# EAGLE schematic MAIN_CNTRL_v02 (EAGLE 9.7.0)

## Sheet 1 of 6: Power
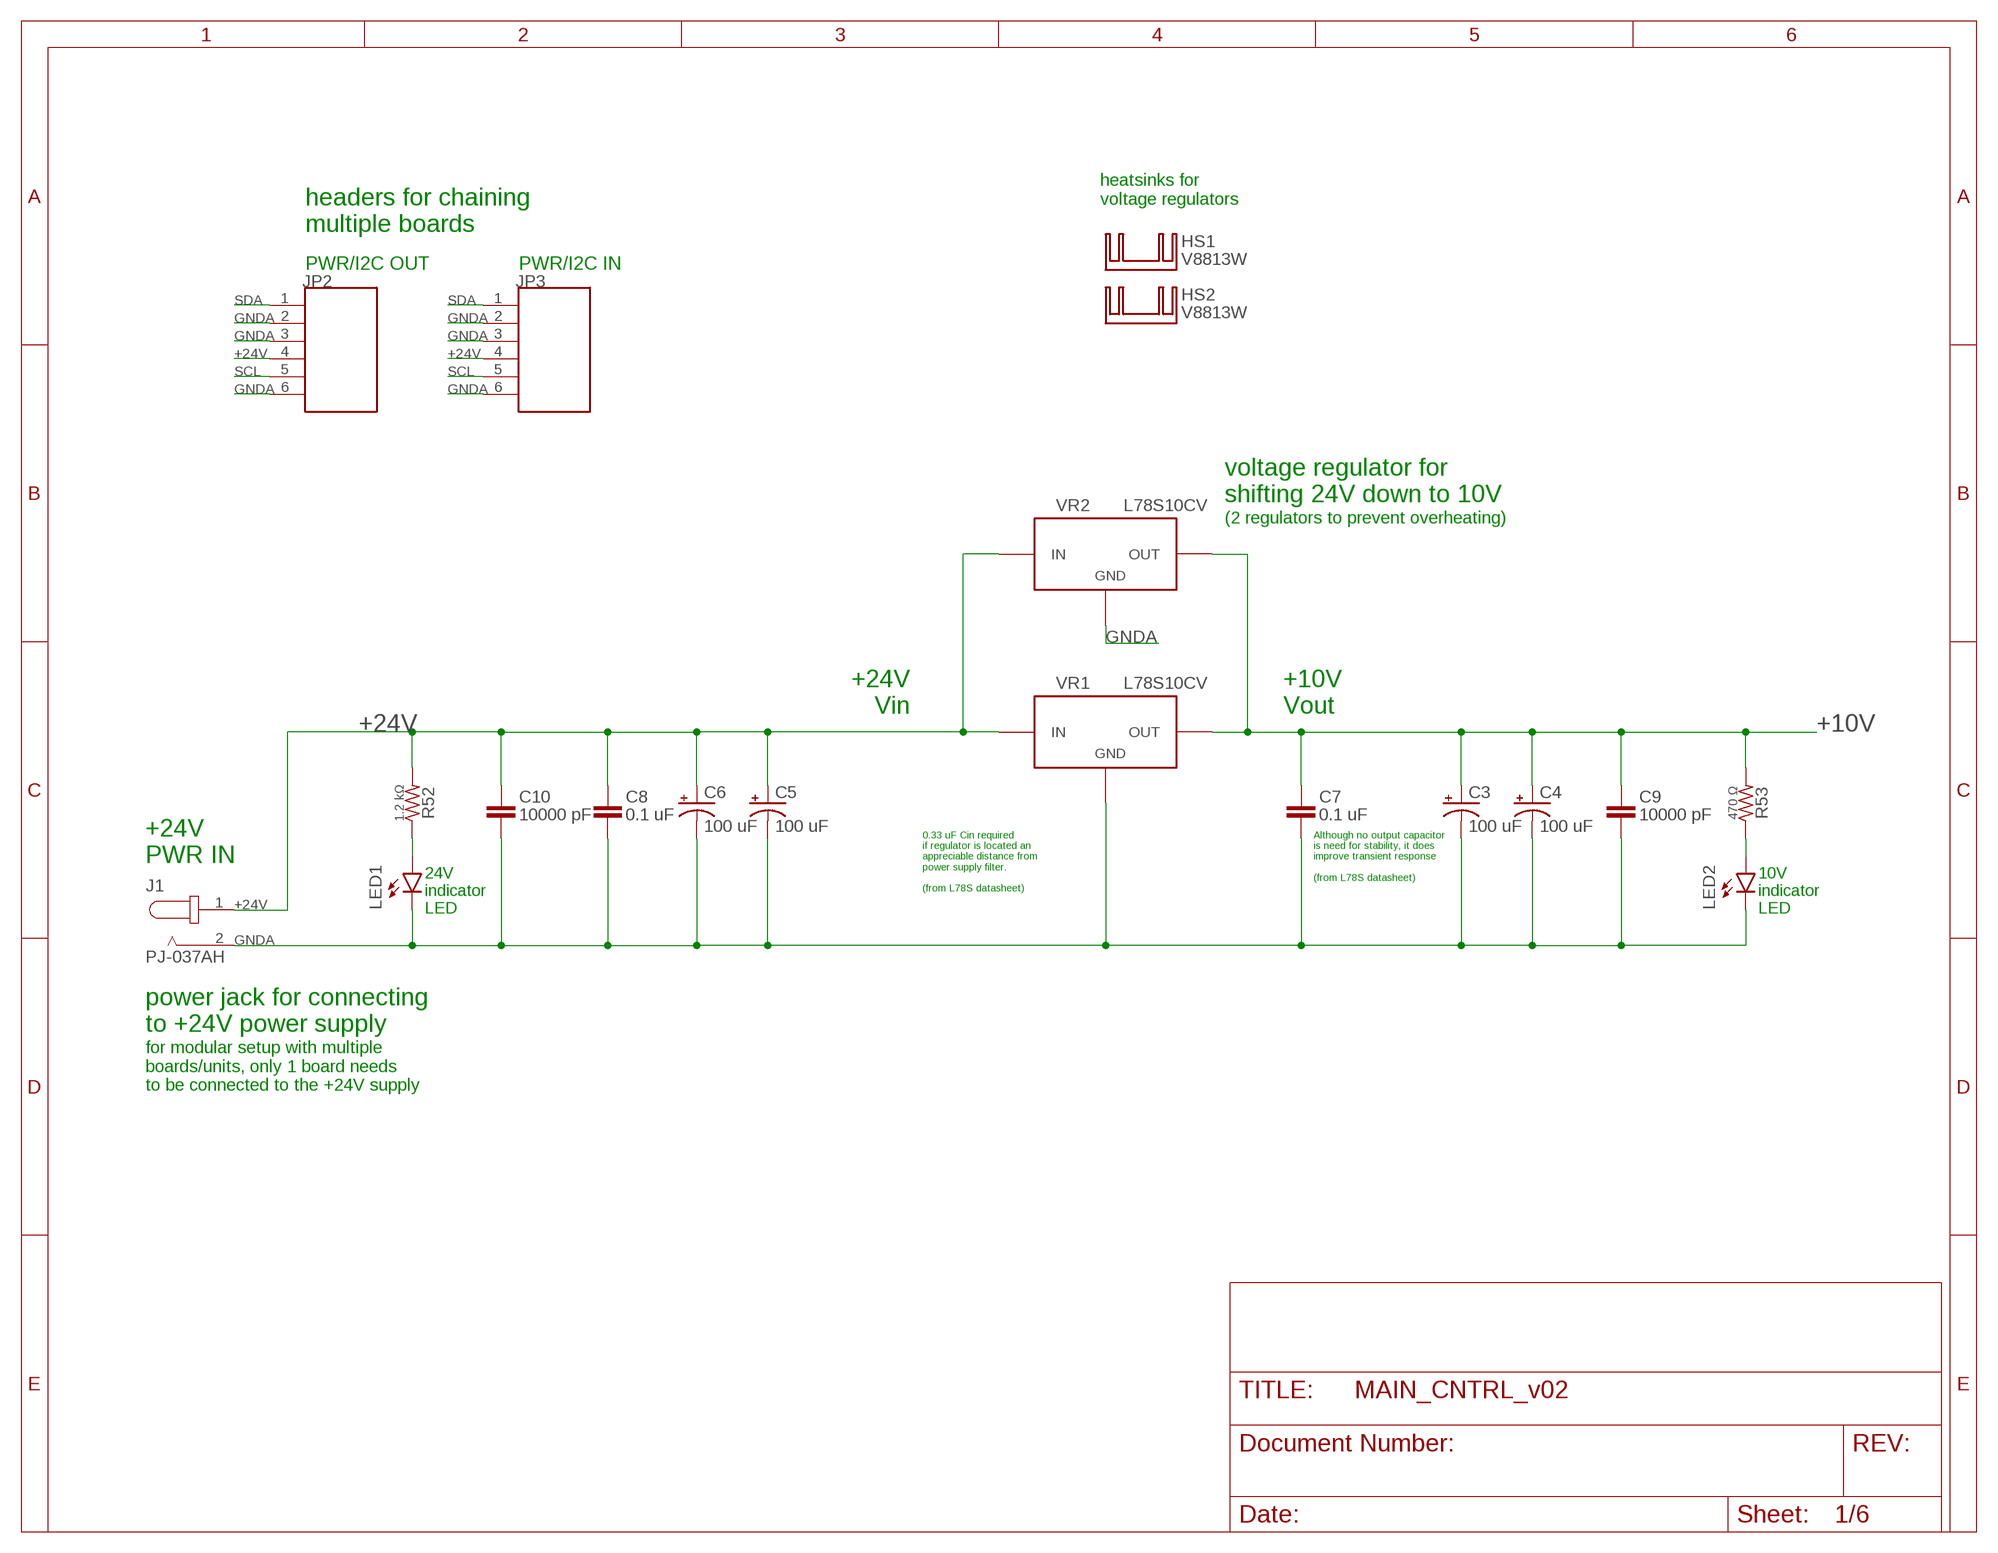
[diagram p0: schematic, sheet 1]

### Parts
C3  100 uF  50THV100M10X10.5  [CAP_J-V_10X10P5_RUB]
C4  100 uF  50THV100M10X10.5  [CAP_J-V_10X10P5_RUB]
C5  100 uF  50THV100M10X10.5  [CAP_J-V_10X10P5_RUB]
C6  100 uF  50THV100M10X10.5  [CAP_J-V_10X10P5_RUB]
C7  0.1 uF  CAP_CGA3E2X7R1H104M080AD  [CAP_1608_TDK]
C8  0.1 uF  CAP_CGA3E2X7R1H104M080AD  [CAP_1608_TDK]
C9  10000 pF  CAP_CGA3E2X7R1H103K080AE  [CAP_1608_TDK]
C10  10000 pF  CAP_CGA3E2X7R1H103K080AE  [CAP_1608_TDK]
HS1  V8813W  [V8813X]
HS2  V8813W  [V8813X]
J1  PJ-037AH  [CUI_PJ-037AH]
JP2  CONN_06_HEADER  [CONN_6P_TE_1761681-1]
JP3  CONN_06_HEADER  [CONN_6P_TE_1761681-1]
LED1  Green LED  LED_VLMG_1300  [LED_VISHAY_VLMX13XX]
LED2  Green LED  LED_VLMG_1300  [LED_VISHAY_VLMX13XX]
R52  1.2 kΩ  RCS06031K20FKEA  [RCS0603_REFLOW]
R53  470 Ω  RCS0603470RFKEA  [RCS0603_REFLOW]
VR1  L78S10CV  [L78S10CV]
VR2  L78S10CV  [L78S10CV]

### Nets
+10V: C3.+ C4.+ C7.1 C9.1 R53.2 VR1.3(OUT) VR2.3(OUT) ; also sheet 2,3,4,6
+24V: C5.+ C6.+ C8.1 C10.1 J1.1 JP2.4 JP3.4 R52.2 VR1.1(IN) VR2.1(IN) ; also sheet 3,4,5,6
GNDA: C3.- C4.- C5.- C6.- C7.2 C8.2 C9.2 C10.2 J1.2 JP2.2 JP2.3 JP2.6 JP3.2 JP3.3 JP3.6 LED1.C LED2.C VR1.2(GND) VR2.2(GND) ; also sheet 2,3,4,5,6
N$18_: LED1.A R52.1
N$19_: LED2.A R53.1
SCL: JP2.5 JP3.5 ; also sheet 2
SDA: JP2.1 JP3.1 ; also sheet 2

### Notes on the sheet
- heatsinks for
  voltage regulators
- headers for chaining
  multiple boards
- PWR/I2C OUT | PWR/I2C IN
- voltage regulator for
  shifting 24V down to 10V
- (2 regulators to prevent overheating)
- +24V
  Vin
- +10V
  Vout
- 0.33 uF Cin required
  if regulator is located an 
  appreciable distance from 
  power supply filter.
  
  (from L78S datasheet)
- Although no output capacitor
  is need for stability, it does
  improve transient response
  
  (from L78S datasheet)
- +24V
  PWR IN
- 24V
  indicator
  LED
- 10V
  indicator
  LED
- power jack for connecting
  to +24V power supply
- for modular setup with multiple
  boards/units, only 1 board needs
  to be connected to the +24V supply

## Sheet 2 of 6: Arduino etc
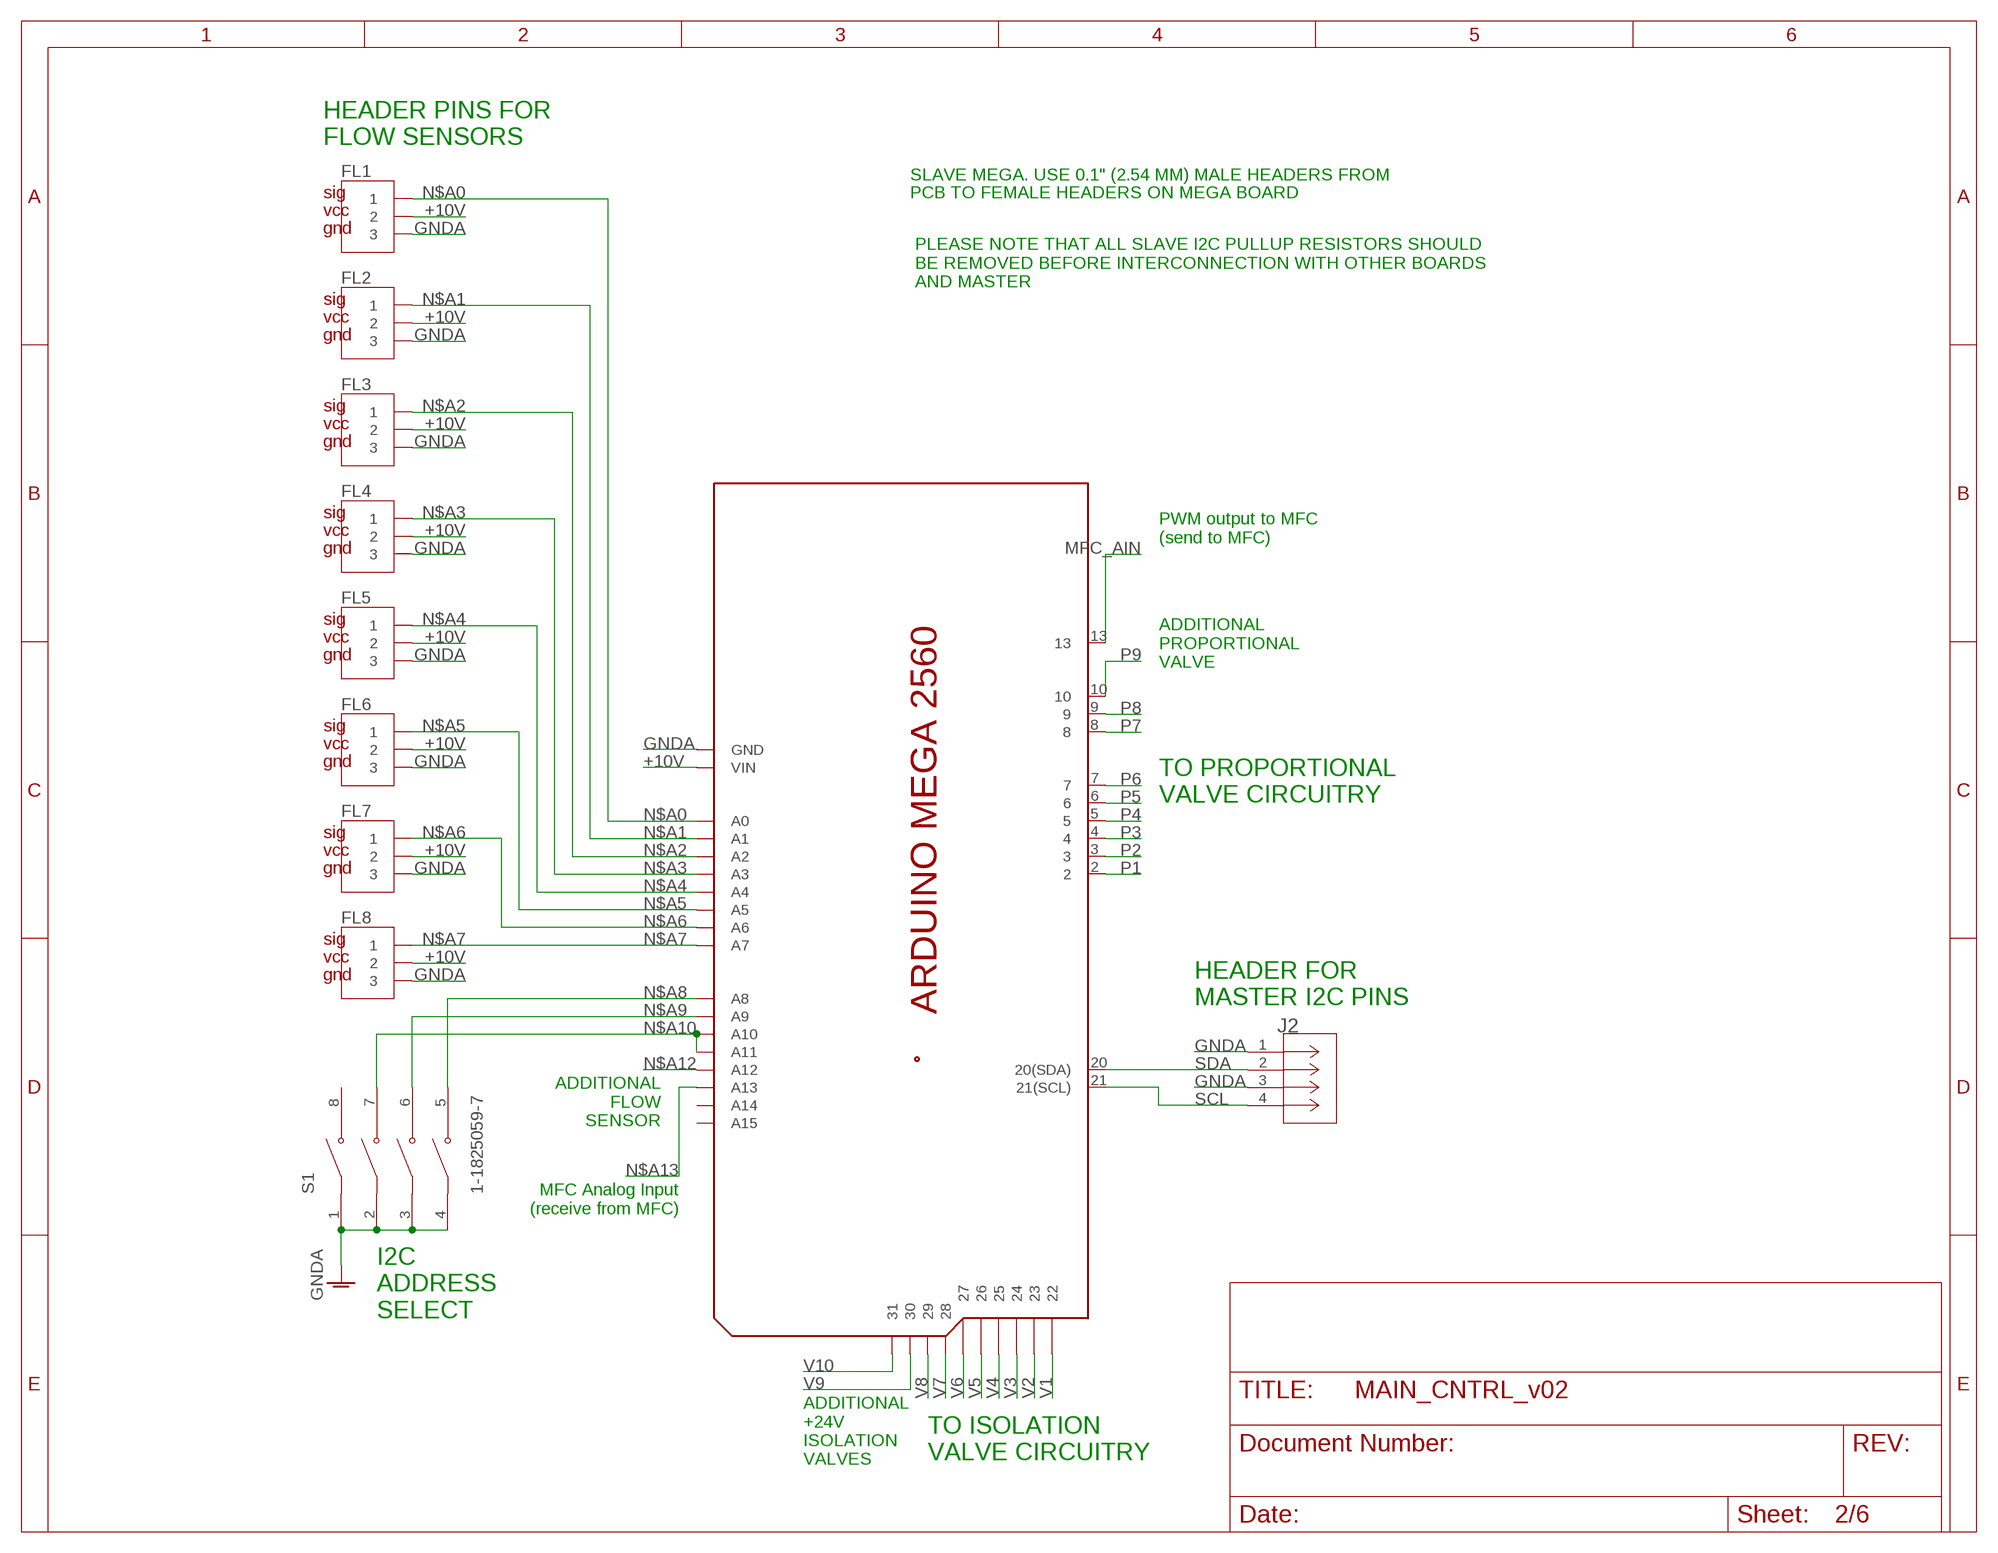
[diagram p1: schematic, sheet 2]

### Parts
FL1  CONN_03_FL  [1X03_FL]
FL2  CONN_03_FL  [1X03_FL]
FL3  CONN_03_FL  [1X03_FL]
FL4  CONN_03_FL  [1X03_FL]
FL5  CONN_03_FL  [1X03_FL]
FL6  CONN_03_FL  [1X03_FL]
FL7  CONN_03_FL  [1X03_FL]
FL8  CONN_03_FL  [1X03_FL]
J2  MOLEX_436500415  [MOLEX_4P_FOOTPRINT]
S1  1-1825059-7  [SW_1-1825059-7]
X1  ARDUINO_MEGA2560_HEADERPINSXX  ARDUINO_MEGA2560  [ARDUINO_MEGA2560_ST_FLIPPED_CUTS]

### Nets
+10V: FL1.2 FL2.2 FL3.2 FL4.2 FL5.2 FL6.2 FL7.2 FL8.2 X1.VIN ; also sheet 1,3,4,6
GNDA: FL1.3 FL2.3 FL3.3 FL4.3 FL5.3 FL6.3 FL7.3 FL8.3 J2.1 J2.3 S1.1 S1.2 S1.3 S1.4 X1.GND X1.GND.(GND) X1.GND..(GND) ; also sheet 1,3,4,5,6
MFC_AIN: X1.13 ; also sheet 6
N$A0: FL1.1 X1.A0
N$A1: FL2.1 X1.A1
N$A2: FL3.1 X1.A2
N$A3: FL4.1 X1.A3
N$A4: FL5.1 X1.A4
N$A5: FL6.1 X1.A5
N$A6: FL7.1 X1.A6
N$A7: FL8.1 X1.A7
N$A8: S1.5 X1.A8
N$A9: S1.6 X1.A9
N$A10: S1.7 X1.A10 X1.A11
N$A12: X1.A12 ; also sheet 6
N$A13: X1.A13 ; also sheet 6
P1: X1.2 ; also sheet 3
P2: X1.3 ; also sheet 3
P3: X1.4 ; also sheet 3
P4: X1.5 ; also sheet 3
P5: X1.6 ; also sheet 4
P6: X1.7 ; also sheet 4
P7: X1.8 ; also sheet 4
P8: X1.9 ; also sheet 4
P9: X1.10 ; also sheet 6
SCL: J2.4 X1.21(21(SCL)) ; also sheet 1
SDA: J2.2 X1.20(20(SDA)) ; also sheet 1
V1: X1.22 ; also sheet 5
V2: X1.23 ; also sheet 5
V3: X1.24 ; also sheet 5
V4: X1.25 ; also sheet 5
V5: X1.26 ; also sheet 5
V6: X1.27 ; also sheet 5
V7: X1.28 ; also sheet 5
V8: X1.29 ; also sheet 5
V9: X1.30 ; also sheet 6
V10: X1.31 ; also sheet 6
Unconnected: S1.8 X1.A14 X1.A15

### Notes on the sheet
- HEADER PINS FOR
  FLOW SENSORS
- SLAVE MEGA. USE 0.1" (2.54 MM) MALE HEADERS FROM
- PCB TO FEMALE HEADERS ON MEGA BOARD
- PLEASE NOTE THAT ALL SLAVE I2C PULLUP RESISTORS SHOULD
   BE REMOVED BEFORE INTERCONNECTION WITH OTHER BOARDS
   AND MASTER
- PWM output to MFC
  (send to MFC)
- ADDITIONAL
  PROPORTIONAL
  VALVE
- TO PROPORTIONAL
  VALVE CIRCUITRY
- HEADER FOR
  MASTER I2C PINS
- ADDITIONAL
  FLOW
  SENSOR
- MFC Analog Input
  (receive from MFC)
- I2C
  ADDRESS
  SELECT
- ADDITIONAL
  +24V
  ISOLATION
  VALVES
- TO ISOLATION
  VALVE CIRCUITRY

## Sheet 3 of 6: Prop.Valves 1-4
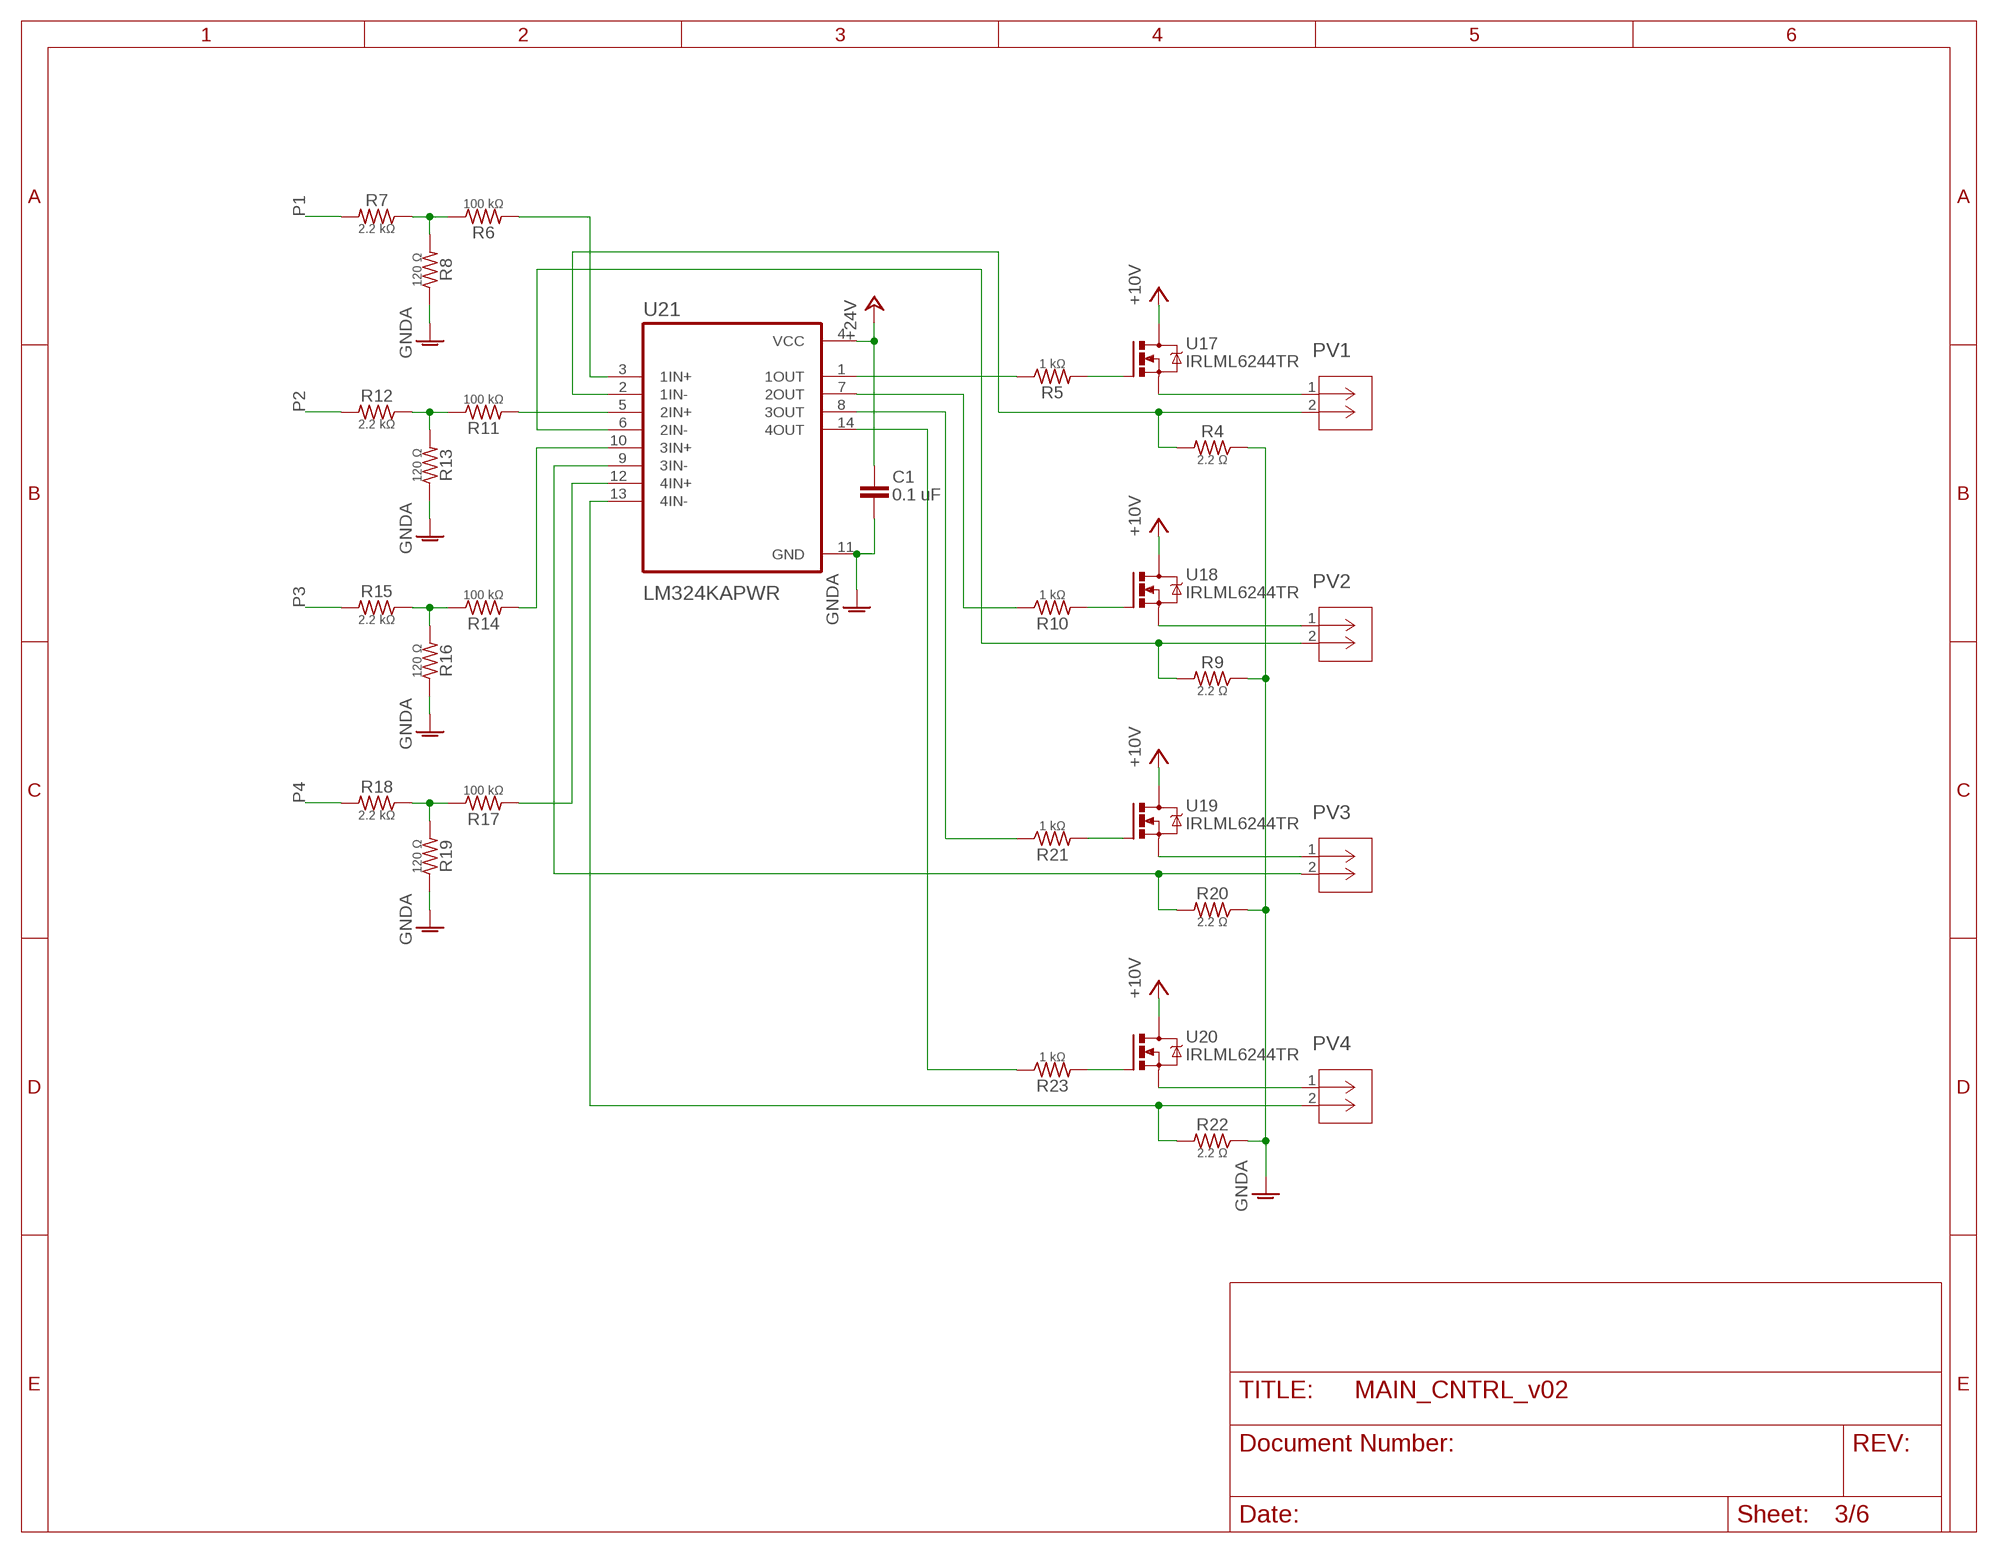
[diagram p2: schematic, sheet 3]

### Parts
C1  0.1 uF  CAP_CGA3E2X7R1H104M080AD  [CAP_1608_TDK]
PV1  MOLEX_436500215PVALVES  [MOLEX_2P_PVALVES]
PV2  MOLEX_436500215PVALVES  [MOLEX_2P_PVALVES]
PV3  MOLEX_436500215PVALVES  [MOLEX_2P_PVALVES]
PV4  MOLEX_436500215PVALVES  [MOLEX_2P_PVALVES]
R4  2.2 Ω  CRCW12062R20FKEA  [CRCW1206_E3_REFLOW]
R5  1 kΩ  ERJPA3F1001V  [RES_ERJPA3F1001V]
R6  100 kΩ  SR0603FR-7T100KL  [RESC1608X55N]
R7  2.2 kΩ  SR0603FR-7T2K2L  [RESC1608X55N]
R8  120 Ω  RCS0603120RFKEA  [RCS0603_REFLOW]
R9  2.2 Ω  CRCW12062R20FKEA  [CRCW1206_E3_REFLOW]
R10  1 kΩ  ERJPA3F1001V  [RES_ERJPA3F1001V]
R11  100 kΩ  SR0603FR-7T100KL  [RESC1608X55N]
R12  2.2 kΩ  SR0603FR-7T2K2L  [RESC1608X55N]
R13  120 Ω  RCS0603120RFKEA  [RCS0603_REFLOW]
R14  100 kΩ  SR0603FR-7T100KL  [RESC1608X55N]
R15  2.2 kΩ  SR0603FR-7T2K2L  [RESC1608X55N]
R16  120 Ω  RCS0603120RFKEA  [RCS0603_REFLOW]
R17  100 kΩ  SR0603FR-7T100KL  [RESC1608X55N]
R18  2.2 kΩ  SR0603FR-7T2K2L  [RESC1608X55N]
R19  120 Ω  RCS0603120RFKEA  [RCS0603_REFLOW]
R20  2.2 Ω  CRCW12062R20FKEA  [CRCW1206_E3_REFLOW]
R21  1 kΩ  ERJPA3F1001V  [RES_ERJPA3F1001V]
R22  2.2 Ω  CRCW12062R20FKEA  [CRCW1206_E3_REFLOW]
R23  1 kΩ  ERJPA3F1001V  [RES_ERJPA3F1001V]
U17  IRLML6244TR  [SOT23]
U18  IRLML6244TR  [SOT23]
U19  IRLML6244TR  [SOT23]
U20  IRLML6244TR  [SOT23]
U21  LM324KAPWR  [SOP65P640X120-14N]

### Nets
+10V: U17.3(D) U18.3(D) U19.3(D) U20.3(D) ; also sheet 1,2,4,6
+24V: C1.1 U21.4(VCC) ; also sheet 1,4,5,6
GNDA: C1.2 R4.1 R8.1 R9.1 R13.1 R16.1 R19.1 R20.1 R22.1 U21.11(GND) ; also sheet 1,2,4,5,6
N$11: R6.1 R7.1 R8.2
N$12: R6.2 U21.3(1IN+)
N$13: R5.2 U17.1(G)
N$21: R11.1 R12.1 R13.2
N$22: R11.2 U21.5(2IN+)
N$23: R10.2 U18.1(G)
N$31: R14.1 R15.1 R16.2
N$32: R14.2 U21.10(3IN+)
N$33: R21.2 U19.1(G)
N$41: R17.1 R18.1 R19.2
N$42: R17.2 U21.12(4IN+)
N$43: R23.2 U20.1(G)
N$PV1_1: PV1.1 U17.2(S)
N$PV1_2: PV1.2 R4.2 U21.2(1IN-)
N$PV1_OUT: R5.1 U21.1(1OUT)
N$PV2_1: PV2.1 U18.2(S)
N$PV2_2: PV2.2 R9.2 U21.6(2IN-)
N$PV2_OUT: R10.1 U21.7(2OUT)
N$PV3_1: PV3.1 U19.2(S)
N$PV3_2: PV3.2 R20.2 U21.9(3IN-)
N$PV3_OUT: R21.1 U21.8(3OUT)
N$PV4_1: PV4.1 U20.2(S)
N$PV4_2: PV4.2 R22.2 U21.13(4IN-)
N$PV4_OUT: R23.1 U21.14(4OUT)
P1: R7.2 ; also sheet 2
P2: R12.2 ; also sheet 2
P3: R15.2 ; also sheet 2
P4: R18.2 ; also sheet 2

## Sheet 4 of 6: Prop. Valves 5-8
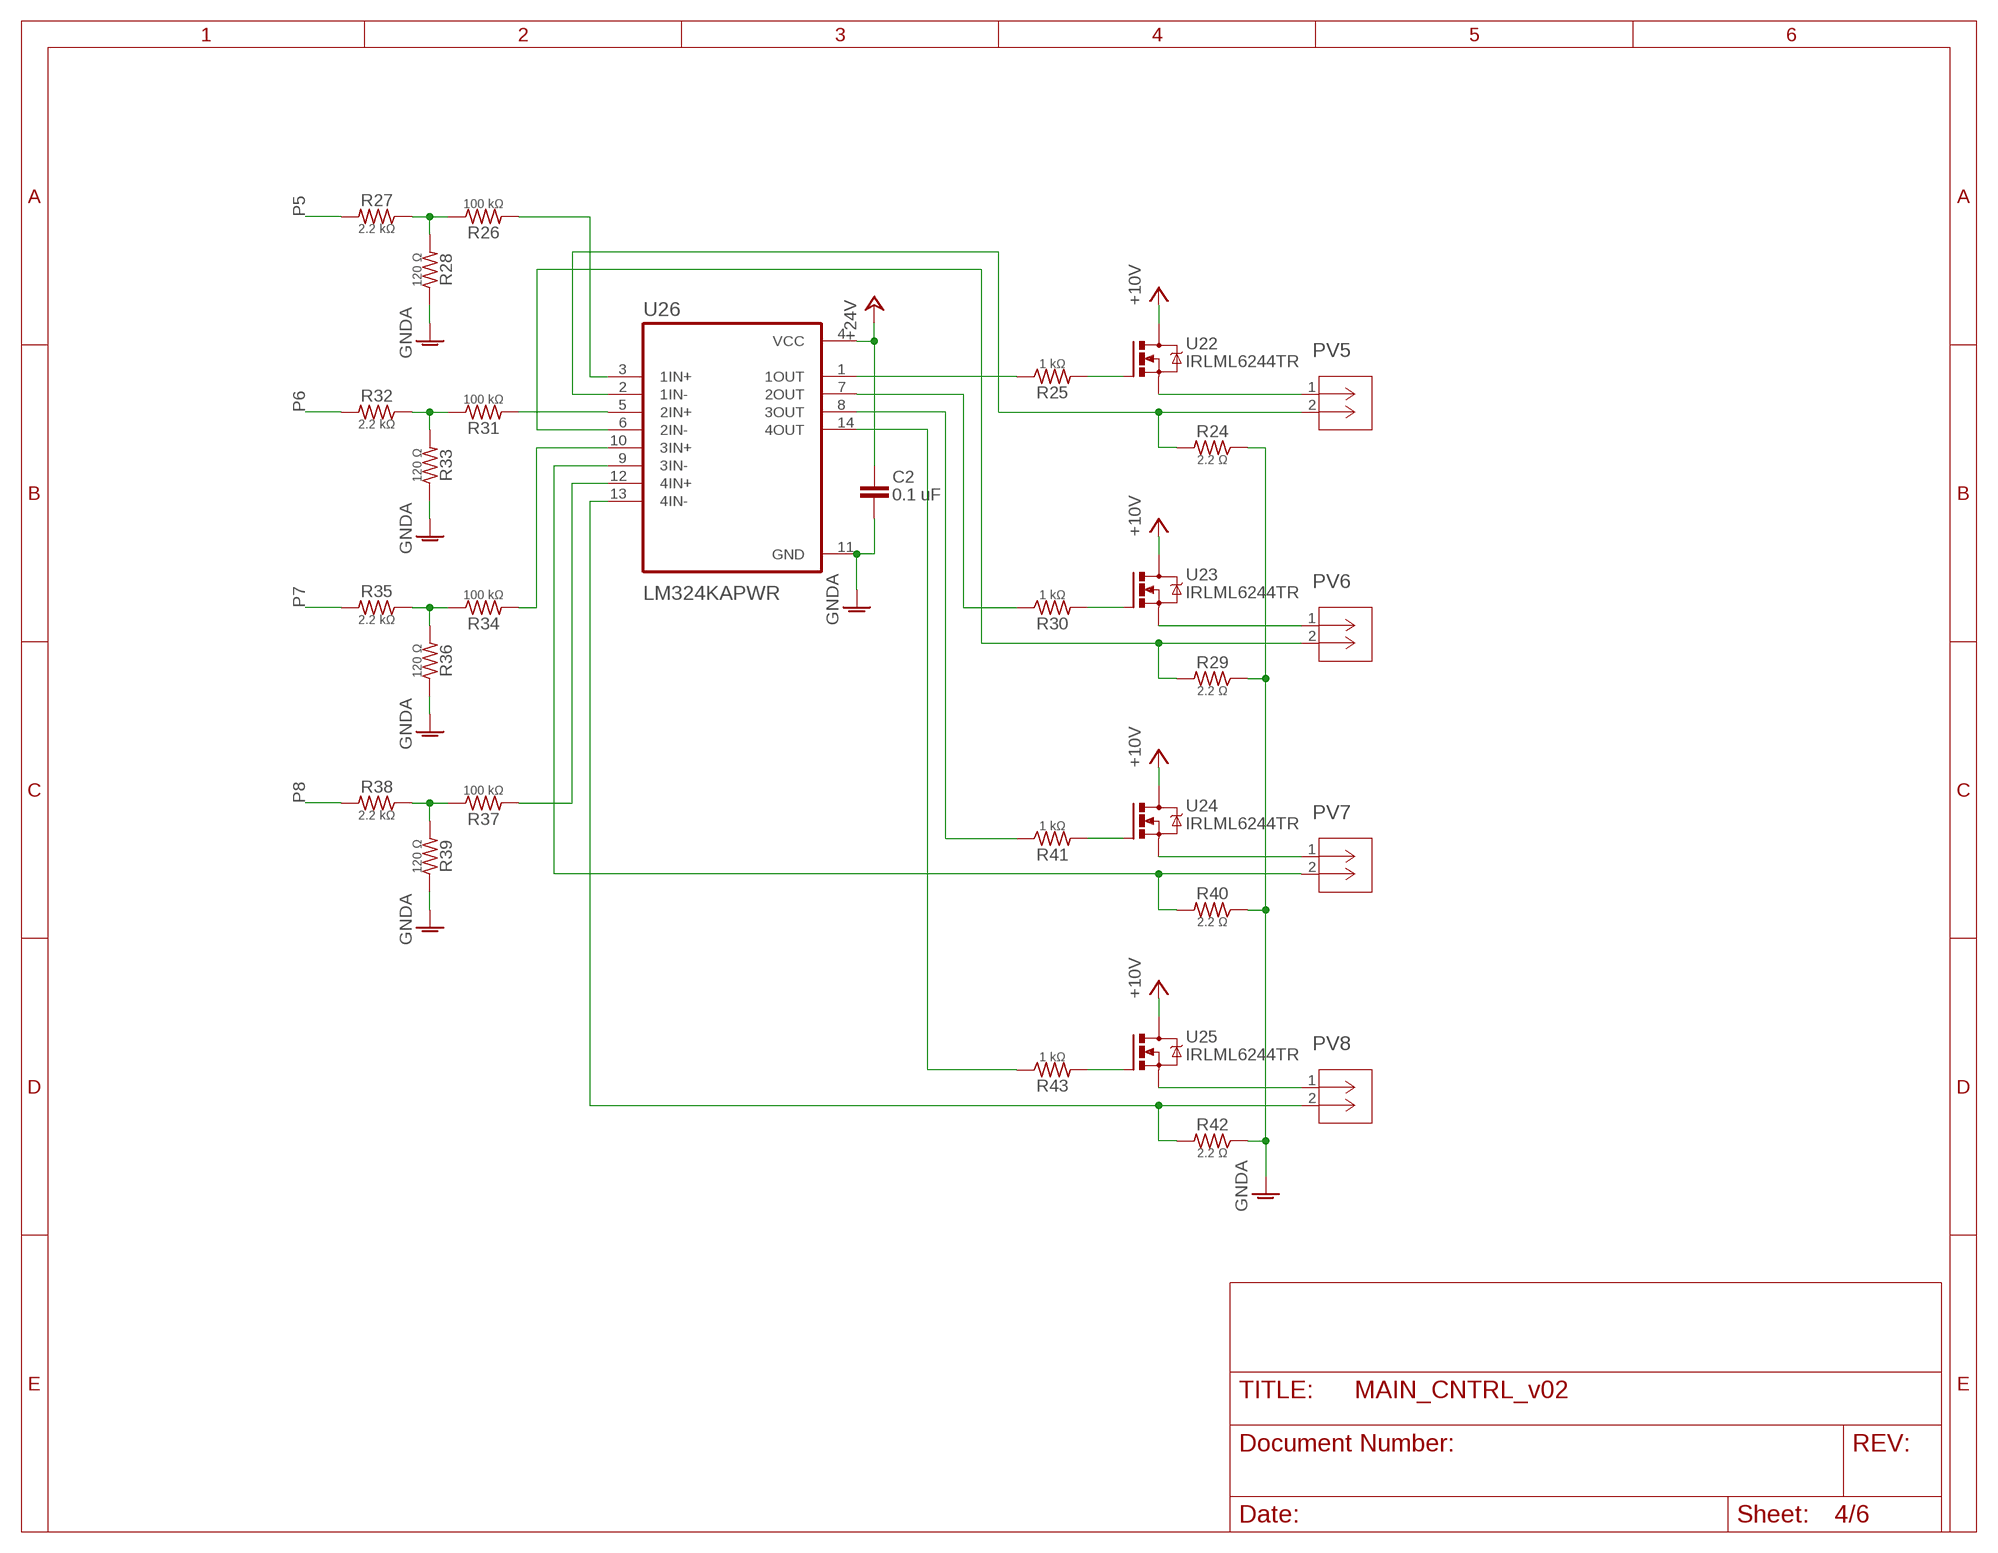
[diagram p3: schematic, sheet 4]

### Parts
C2  0.1 uF  CAP_CGA3E2X7R1H104M080AD  [CAP_1608_TDK]
PV5  MOLEX_436500215PVALVES  [MOLEX_2P_PVALVES]
PV6  MOLEX_436500215PVALVES  [MOLEX_2P_PVALVES]
PV7  MOLEX_436500215PVALVES  [MOLEX_2P_PVALVES]
PV8  MOLEX_436500215PVALVES  [MOLEX_2P_PVALVES]
R24  2.2 Ω  CRCW12062R20FKEA  [CRCW1206_E3_REFLOW]
R25  1 kΩ  ERJPA3F1001V  [RES_ERJPA3F1001V]
R26  100 kΩ  SR0603FR-7T100KL  [RESC1608X55N]
R27  2.2 kΩ  SR0603FR-7T2K2L  [RESC1608X55N]
R28  120 Ω  RCS0603120RFKEA  [RCS0603_REFLOW]
R29  2.2 Ω  CRCW12062R20FKEA  [CRCW1206_E3_REFLOW]
R30  1 kΩ  ERJPA3F1001V  [RES_ERJPA3F1001V]
R31  100 kΩ  SR0603FR-7T100KL  [RESC1608X55N]
R32  2.2 kΩ  SR0603FR-7T2K2L  [RESC1608X55N]
R33  120 Ω  RCS0603120RFKEA  [RCS0603_REFLOW]
R34  100 kΩ  SR0603FR-7T100KL  [RESC1608X55N]
R35  2.2 kΩ  SR0603FR-7T2K2L  [RESC1608X55N]
R36  120 Ω  RCS0603120RFKEA  [RCS0603_REFLOW]
R37  100 kΩ  SR0603FR-7T100KL  [RESC1608X55N]
R38  2.2 kΩ  SR0603FR-7T2K2L  [RESC1608X55N]
R39  120 Ω  RCS0603120RFKEA  [RCS0603_REFLOW]
R40  2.2 Ω  CRCW12062R20FKEA  [CRCW1206_E3_REFLOW]
R41  1 kΩ  ERJPA3F1001V  [RES_ERJPA3F1001V]
R42  2.2 Ω  CRCW12062R20FKEA  [CRCW1206_E3_REFLOW]
R43  1 kΩ  ERJPA3F1001V  [RES_ERJPA3F1001V]
U22  IRLML6244TR  [SOT23]
U23  IRLML6244TR  [SOT23]
U24  IRLML6244TR  [SOT23]
U25  IRLML6244TR  [SOT23]
U26  LM324KAPWR  [SOP65P640X120-14N]

### Nets
+10V: U22.3(D) U23.3(D) U24.3(D) U25.3(D) ; also sheet 1,2,3,6
+24V: C2.1 U26.4(VCC) ; also sheet 1,3,5,6
GNDA: C2.2 R24.1 R28.1 R29.1 R33.1 R36.1 R39.1 R40.1 R42.1 U26.11(GND) ; also sheet 1,2,3,5,6
N$51: R26.1 R27.1 R28.2
N$52: R26.2 U26.3(1IN+)
N$53: R25.2 U22.1(G)
N$61: R31.1 R32.1 R33.2
N$62: R31.2 U26.5(2IN+)
N$63: R30.2 U23.1(G)
N$71: R34.1 R35.1 R36.2
N$72: R34.2 U26.10(3IN+)
N$73: R41.2 U24.1(G)
N$81: R37.1 R38.1 R39.2
N$82: R37.2 U26.12(4IN+)
N$83: R43.2 U25.1(G)
N$PV5_1: PV5.1 U22.2(S)
N$PV5_2: PV5.2 R24.2 U26.2(1IN-)
N$PV5_OUT: R25.1 U26.1(1OUT)
N$PV6_1: PV6.1 U23.2(S)
N$PV6_2: PV6.2 R29.2 U26.6(2IN-)
N$PV6_OUT: R30.1 U26.7(2OUT)
N$PV7_1: PV7.1 U24.2(S)
N$PV7_2: PV7.2 R40.2 U26.9(3IN-)
N$PV7_OUT: R41.1 U26.8(3OUT)
N$PV8_1: PV8.1 U25.2(S)
N$PV8_2: PV8.2 R42.2 U26.13(4IN-)
N$PV8_OUT: R43.1 U26.14(4OUT)
P5: R27.2 ; also sheet 2
P6: R32.2 ; also sheet 2
P7: R35.2 ; also sheet 2
P8: R38.2 ; also sheet 2

## Sheet 5 of 6: Isolation Valves
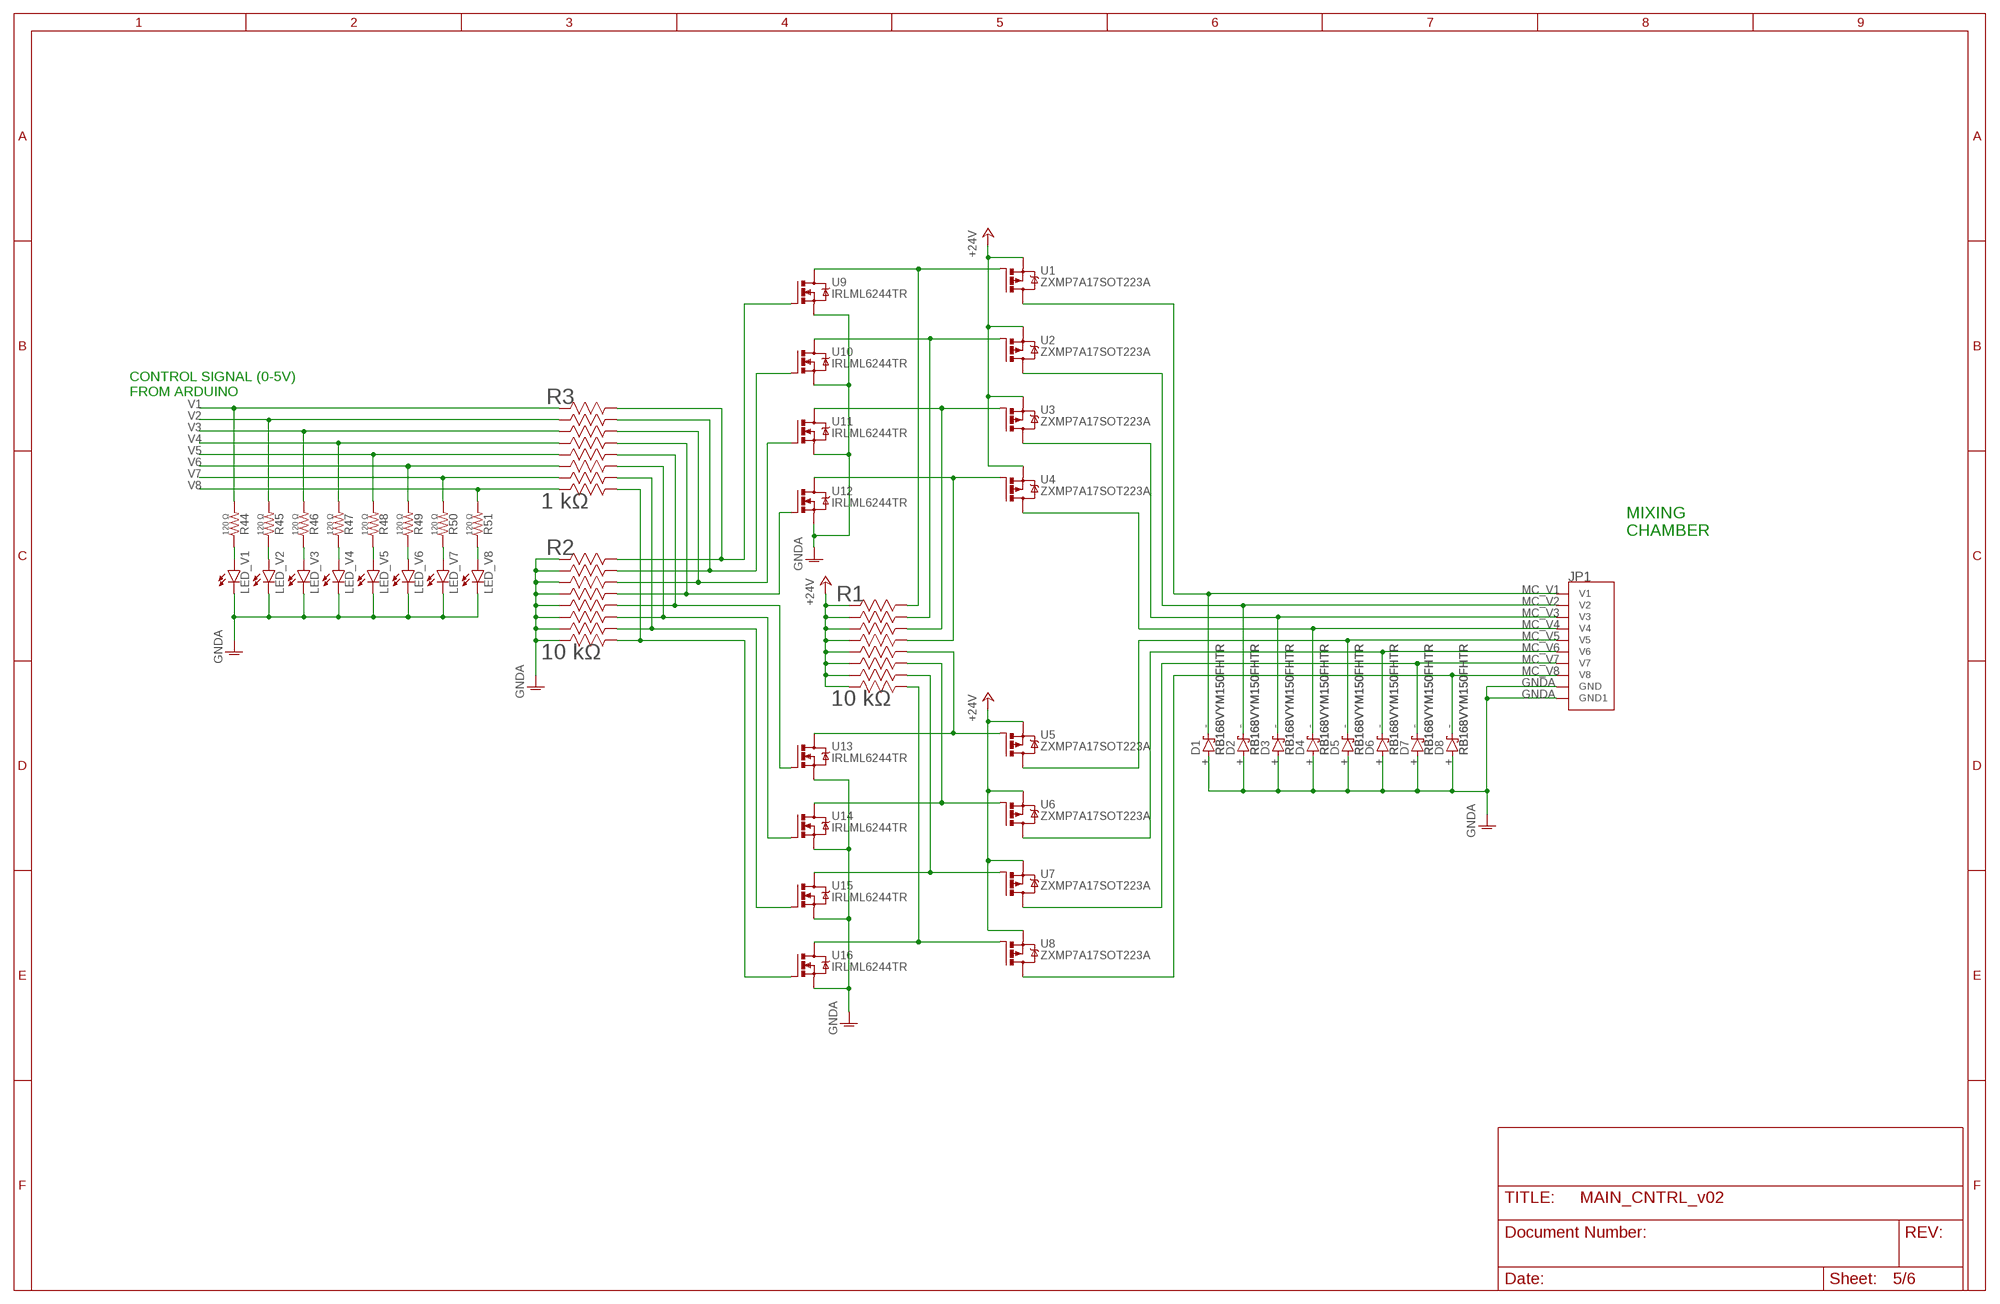
[diagram p4: schematic, sheet 5]

### Parts
D1  RB168VYM150FHTR  [DIO_RB160VAM_ROM]
D2  RB168VYM150FHTR  [DIO_RB160VAM_ROM]
D3  RB168VYM150FHTR  [DIO_RB160VAM_ROM]
D4  RB168VYM150FHTR  [DIO_RB160VAM_ROM]
D5  RB168VYM150FHTR  [DIO_RB160VAM_ROM]
D6  RB168VYM150FHTR  [DIO_RB160VAM_ROM]
D7  RB168VYM150FHTR  [DIO_RB160VAM_ROM]
D8  RB168VYM150FHTR  [DIO_RB160VAM_ROM]
JP1  CONN_10P_CUSTOM_N2510-6002RBV02  CONN_10P_TE_1761681-3  [CONN_10P_TE_1761681-3_SE_FOR_V02]
LED_V1  Blue LED  LED_VLMB_1300  [LED_VISHAY_VLMX13XX]
LED_V2  Blue LED  LED_VLMB_1300  [LED_VISHAY_VLMX13XX]
LED_V3  Blue LED  LED_VLMB_1300  [LED_VISHAY_VLMX13XX]
LED_V4  Blue LED  LED_VLMB_1300  [LED_VISHAY_VLMX13XX]
LED_V5  Blue LED  LED_VLMB_1300  [LED_VISHAY_VLMX13XX]
LED_V6  Blue LED  LED_VLMB_1300  [LED_VISHAY_VLMX13XX]
LED_V7  Blue LED  LED_VLMB_1300  [LED_VISHAY_VLMX13XX]
LED_V8  Blue LED  LED_VLMB_1300  [LED_VISHAY_VLMX13XX]
R1  10 kΩ  RES_4816P-1-103LF  [BO_4816P]
R2  10 kΩ  RES_4816P-1-103LF  [BO_4816P]
R3  1 kΩ  RES_4816P-1-102LF  [BO_4816P]
R44  120 Ω  RCS0603120RFKEA  [RCS0603_REFLOW]
R45  120 Ω  RCS0603120RFKEA  [RCS0603_REFLOW]
R46  120 Ω  RCS0603120RFKEA  [RCS0603_REFLOW]
R47  120 Ω  RCS0603120RFKEA  [RCS0603_REFLOW]
R48  120 Ω  RCS0603120RFKEA  [RCS0603_REFLOW]
R49  120 Ω  RCS0603120RFKEA  [RCS0603_REFLOW]
R50  120 Ω  RCS0603120RFKEA  [RCS0603_REFLOW]
R51  120 Ω  RCS0603120RFKEA  [RCS0603_REFLOW]
U1  ZXMP7A17SOT223A  [SOT223]
U2  ZXMP7A17SOT223A  [SOT223]
U3  ZXMP7A17SOT223A  [SOT223]
U4  ZXMP7A17SOT223A  [SOT223]
U5  ZXMP7A17SOT223A  [SOT223]
U6  ZXMP7A17SOT223A  [SOT223]
U7  ZXMP7A17SOT223A  [SOT223]
U8  ZXMP7A17SOT223A  [SOT223]
U9  IRLML6244TR  [SOT23]
U10  IRLML6244TR  [SOT23]
U11  IRLML6244TR  [SOT23]
U12  IRLML6244TR  [SOT23]
U13  IRLML6244TR  [SOT23]
U14  IRLML6244TR  [SOT23]
U15  IRLML6244TR  [SOT23]
U16  IRLML6244TR  [SOT23]

### Nets
+24V: R1.1 R1.2 R1.3 R1.4 R1.5 R1.6 R1.7 R1.8 U1.3(S) U2.3(S) U3.3(S) U4.3(S) U5.3(S) U6.3(S) U7.3(S) U8.3(S) ; also sheet 1,3,4,6
GNDA: D1.2(A) D2.2(A) D3.2(A) D4.2(A) D5.2(A) D6.2(A) D7.2(A) D8.2(A) JP1.GND JP1.GND.(GND1) LED_V1.C LED_V2.C LED_V3.C LED_V4.C LED_V5.C LED_V6.C LED_V7.C LED_V8.C R2.1 R2.2 R2.3 R2.4 R2.5 R2.6 R2.7 R2.8 U9.2(S) U10.2(S) U11.2(S) U12.2(S) U13.2(S) U14.2(S) U15.2(S) U16.2(S) ; also sheet 1,2,3,4,6
MC_V1: D1.1(C) JP1.V1 U1.2(D) U1.4(D)
MC_V2: D2.1(C) JP1.V2 U2.2(D) U2.4(D)
MC_V3: D3.1(C) JP1.V3 U3.2(D) U3.4(D)
MC_V4: D4.1(C) JP1.V4 U4.2(D) U4.4(D)
MC_V5: D5.1(C) JP1.V5 U5.2(D) U5.4(D)
MC_V6: D6.1(C) JP1.V6 U6.2(D) U6.4(D)
MC_V7: D7.1(C) JP1.V7 U7.2(D) U7.4(D)
MC_V8: D8.1(C) JP1.V8 U8.2(D) U8.4(D)
N$1-1: R1.16 U1.1(G) U9.3(D)
N$1-2: R2.16 R3.16 U9.1(G)
N$2-1: R1.15 U2.1(G) U10.3(D)
N$2-2: R2.15 R3.15 U10.1(G)
N$3-1: R1.14 U3.1(G) U11.3(D)
N$3-2: R2.14 R3.14 U11.1(G)
N$4-1: R1.13 U4.1(G) U12.3(D)
N$4-2: R2.13 R3.13 U12.1(G)
N$5-1: R1.12 U5.1(G) U13.3(D)
N$5-2: R2.12 R3.12 U13.1(G)
N$6-1: R1.11 U6.1(G) U14.3(D)
N$6-2: R2.11 R3.11 U14.1(G)
N$7-1: R1.10 U7.1(G) U15.3(D)
N$7-2: R2.10 R3.10 U15.1(G)
N$8-1: R1.9 U8.1(G) U16.3(D)
N$8-2: R2.9 R3.9 U16.1(G)
N$LED1: LED_V1.A R44.1
N$LED2: LED_V2.A R45.1
N$LED3: LED_V3.A R46.1
N$LED4: LED_V4.A R47.1
N$LED5: LED_V5.A R48.1
N$LED6: LED_V6.A R49.1
N$LED7: LED_V7.A R50.1
N$LED8: LED_V8.A R51.1
V1: R3.1 R44.2 ; also sheet 2
V2: R3.2 R45.2 ; also sheet 2
V3: R3.3 R46.2 ; also sheet 2
V4: R3.4 R47.2 ; also sheet 2
V5: R3.5 R48.2 ; also sheet 2
V6: R3.6 R49.2 ; also sheet 2
V7: R3.7 R50.2 ; also sheet 2
V8: R3.8 R51.2 ; also sheet 2

### Notes on the sheet
- CONTROL SIGNAL (0-5V)
  FROM ARDUINO
- MIXING
  CHAMBER

## Sheet 6 of 6: Auxiliary components
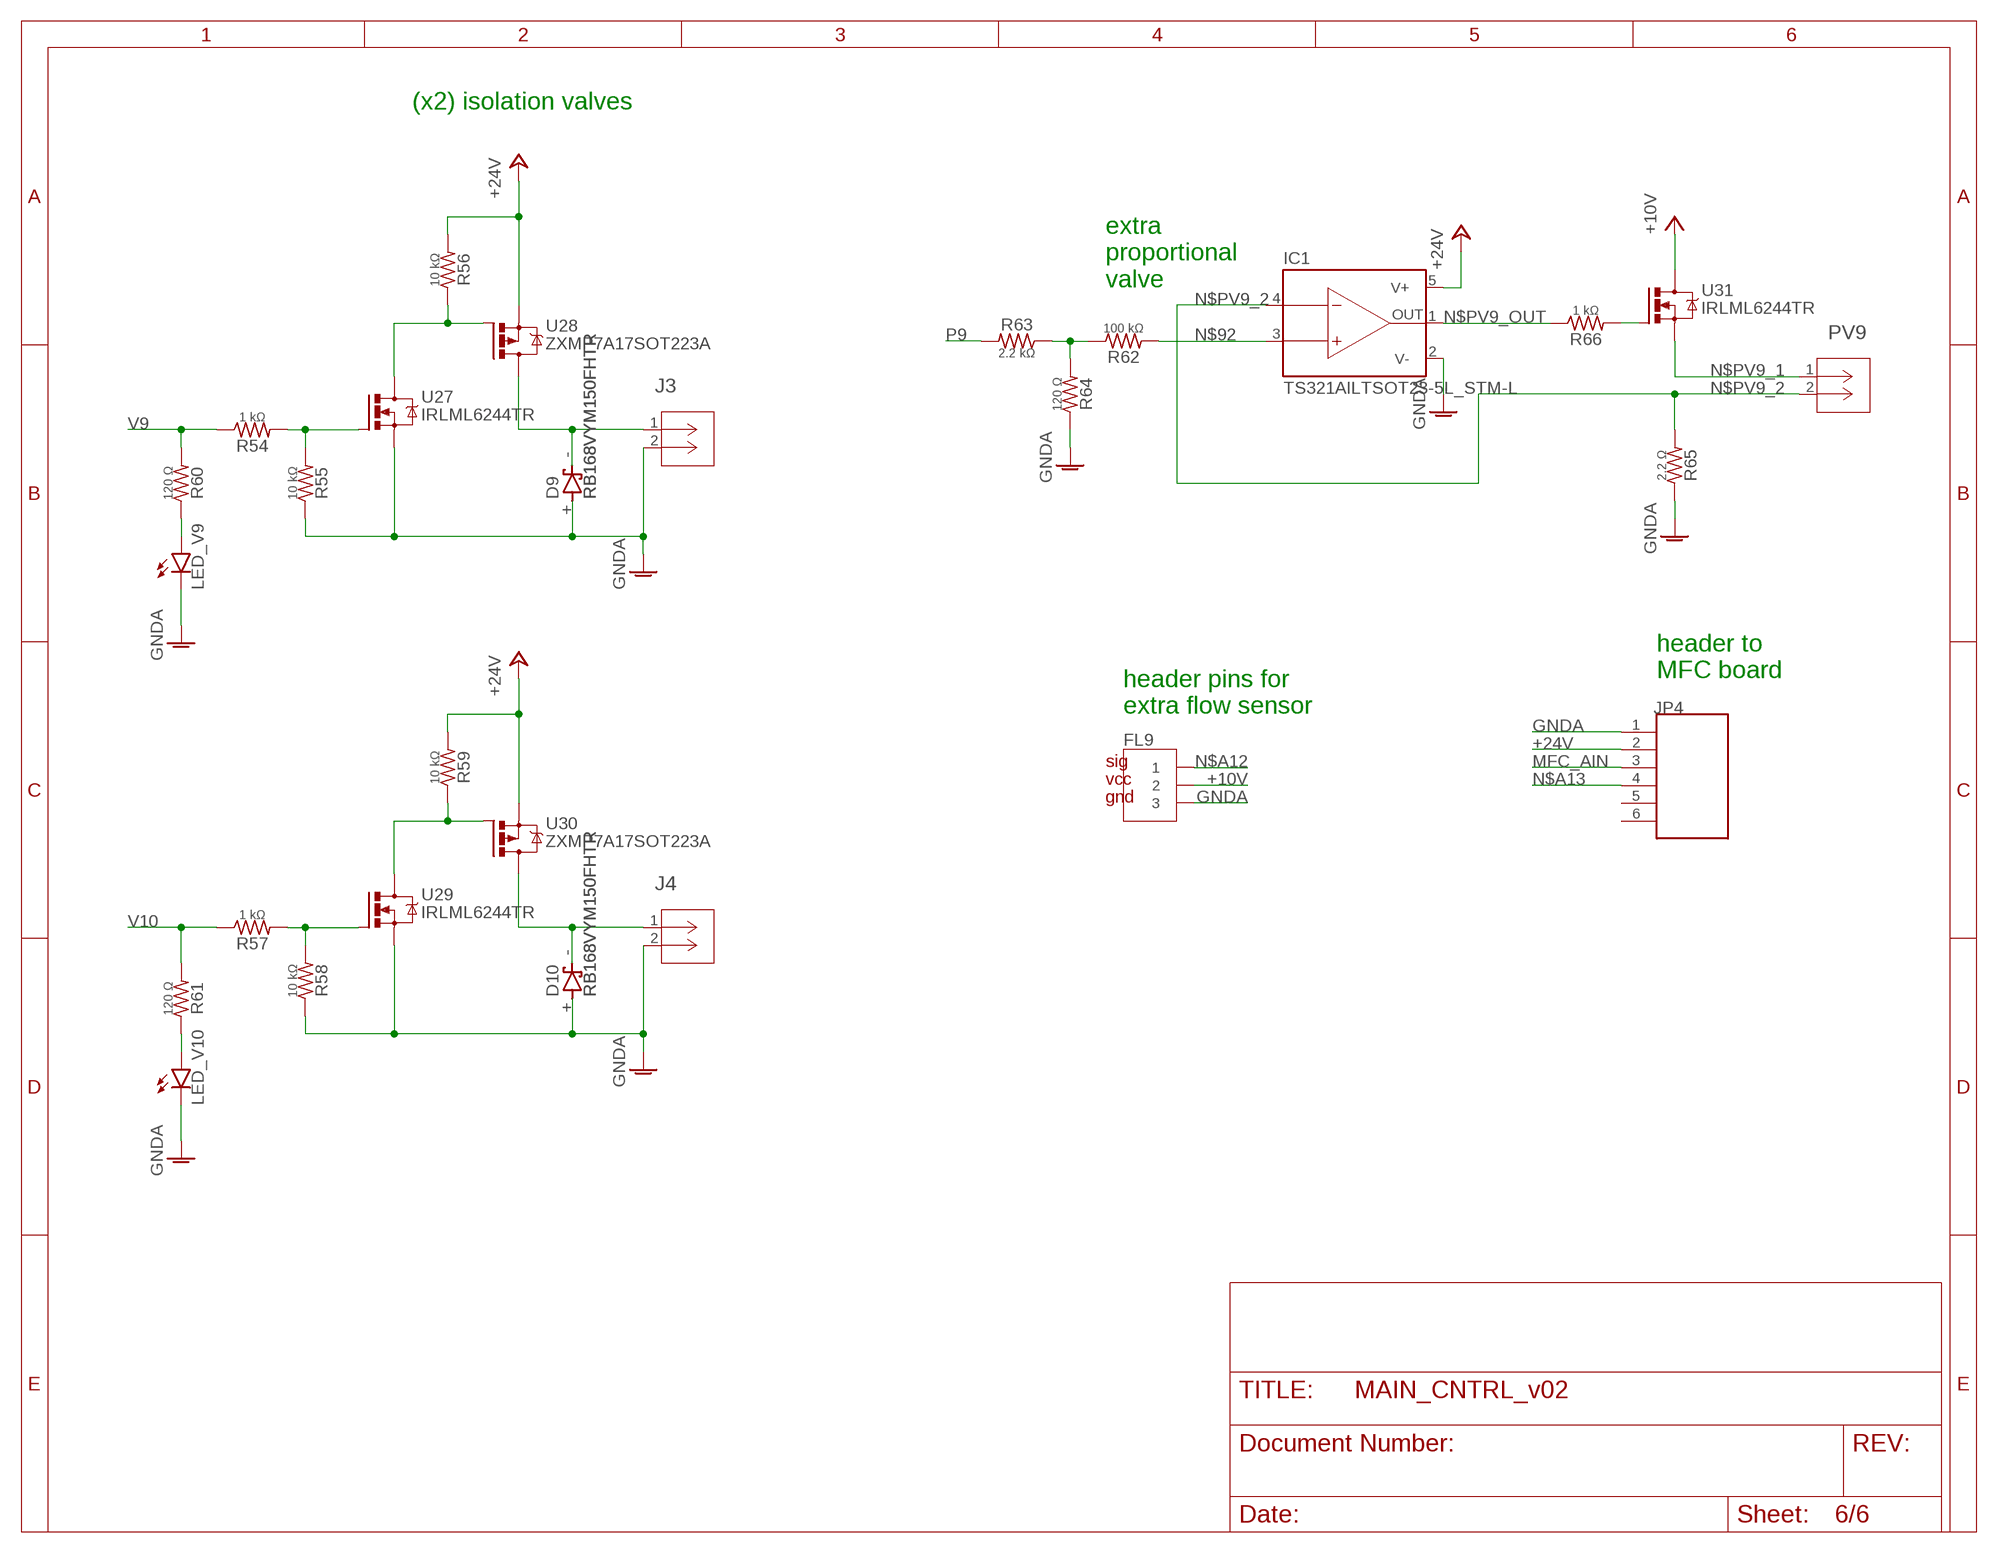
[diagram p5: schematic, sheet 6]

### Parts
D9  RB168VYM150FHTR  [DIO_RB160VAM_ROM]
D10  RB168VYM150FHTR  [DIO_RB160VAM_ROM]
FL9  CONN_03_FL  [1X03_FL]
IC1  TS321AILTSOT23-5L_STM-L  [SOT23-5L_STM-L]
J3  MOLEX_436500215  [MOLEX_2P_FOOTPRINT]
J4  MOLEX_436500215  [MOLEX_2P_FOOTPRINT]
JP4  CONN_06_HEADER  [CONN_6P_TE_1761681-1]
LED_V9  Blue LED  LED_VLMB_1300  [LED_VISHAY_VLMX13XX]
LED_V10  Blue LED  LED_VLMB_1300  [LED_VISHAY_VLMX13XX]
PV9  MOLEX_436500215PVALVES  [MOLEX_2P_PVALVES]
R54  1 kΩ  ERJPA3F1001V  [RES_ERJPA3F1001V]
R55  10 kΩ  ERJ-PA3F1002V  [RES_ERJPA3F1001V]
R56  10 kΩ  ERJ-PA3F1002V  [RES_ERJPA3F1001V]
R57  1 kΩ  ERJPA3F1001V  [RES_ERJPA3F1001V]
R58  10 kΩ  ERJ-PA3F1002V  [RES_ERJPA3F1001V]
R59  10 kΩ  ERJ-PA3F1002V  [RES_ERJPA3F1001V]
R60  120 Ω  RCS0603120RFKEA  [RCS0603_REFLOW]
R61  120 Ω  RCS0603120RFKEA  [RCS0603_REFLOW]
R62  100 kΩ  SR0603FR-7T100KL  [RESC1608X55N]
R63  2.2 kΩ  SR0603FR-7T2K2L  [RESC1608X55N]
R64  120 Ω  RCS0603120RFKEA  [RCS0603_REFLOW]
R65  2.2 Ω  CRCW12062R20FKEA  [CRCW1206_E3_REFLOW]
R66  1 kΩ  ERJPA3F1001V  [RES_ERJPA3F1001V]
U27  IRLML6244TR  [SOT23]
U28  ZXMP7A17SOT223A  [SOT223]
U29  IRLML6244TR  [SOT23]
U30  ZXMP7A17SOT223A  [SOT223]
U31  IRLML6244TR  [SOT23]

### Nets
+10V: FL9.2 U31.3(D) ; also sheet 1,2,3,4
+24V: IC1.5(V+) JP4.2 R56.2 R59.2 U28.3(S) U30.3(S) ; also sheet 1,3,4,5
GNDA: D9.2(A) D10.2(A) FL9.3 IC1.2(V-) J3.2 J4.2 JP4.1 LED_V9.C LED_V10.C R55.1 R58.1 R64.1 R65.1 U27.2(S) U29.2(S) ; also sheet 1,2,3,4,5
MFC_AIN: JP4.3 ; also sheet 2
N$9-1: R56.1 U27.3(D) U28.1(G)
N$9-2: R54.2 R55.2 U27.1(G)
N$10-1: R59.1 U29.3(D) U30.1(G)
N$10-2: R57.2 R58.2 U29.1(G)
N$91: R62.1 R63.1 R64.2
N$92: IC1.3(+IN) R62.2
N$94: R66.2 U31.1(G)
N$A12: FL9.1 ; also sheet 2
N$A13: JP4.4 ; also sheet 2
N$LED9: LED_V9.A R60.1
N$LED10: LED_V10.A R61.1
N$PV9_1: PV9.1 U31.2(S)
N$PV9_2: IC1.4(-IN) PV9.2 R65.2
N$PV9_OUT: IC1.1(OUT) R66.1
N$V9: D9.1(C) J3.1 U28.2(D) U28.4(D)
N$V10: D10.1(C) J4.1 U30.2(D) U30.4(D)
P9: R63.2 ; also sheet 2
V9: R54.1 R60.2 ; also sheet 2
V10: R57.1 R61.2 ; also sheet 2
Unconnected: JP4.5 JP4.6

### Notes on the sheet
- (x2) isolation valves
- extra
  proportional
  valve
- header to
  MFC board
- header pins for
  extra flow sensor

## Library data of the parts
C1 = lib_v3:CAP_CGA3E2X7R1H104M080AD: Capacitor 0.1 µF ±20% 50V Ceramic Capacitor X7R 0603 (1608 Metric); DESCRIPTION_VALUE: CAP CER 0.1UF 50V X7R 0603 EPOXY; DIGI-KEY_PART_NUMBER: 445-9834-1-ND; DIGIKEY_LINK: https://www.digikey.com/en/products/detail/tdk-corporation/CGA3E2X7R1H104M080AD/3933567?s=N4IgTCBcDaIMIHECCBmAomAGgdgEoEYAJfABgBYBZEgDhKQBEQBdAXyA; FOOTPRINT_PACKAGE: 0603 (1608 Metric); FUNCTION: prop valve driver (1-5); MF: TDK Corporation; MF_PART_NUMBER: CGA3E2X7R1H104M080AD
C2 = lib_v3:CAP_CGA3E2X7R1H104M080AD: Capacitor 0.1 µF ±20% 50V Ceramic Capacitor X7R 0603 (1608 Metric); DESCRIPTION_VALUE: CAP CER 0.1UF 50V X7R 0603 EPOXY; DIGI-KEY_PART_NUMBER: 445-9834-1-ND; DIGIKEY_LINK: https://www.digikey.com/en/products/detail/tdk-corporation/CGA3E2X7R1H104M080AD/3933567?s=N4IgTCBcDaIMIHECCBmAomAGgdgEoEYAJfABgBYBZEgDhKQBEQBdAXyA; FOOTPRINT_PACKAGE: 0603 (1608 Metric); FUNCTION: prop valve driver (5-8); MF: TDK Corporation; MF_PART_NUMBER: CGA3E2X7R1H104M080AD
C3 C4 = lib_v3:50THV100M10X10.5: Capacitor 100 µF ±20% 50V Aluminum Electrolytic Capacitor Radial, Can - SMD 250mOhm @ 100kHz 3000 Hrs @ 125°C; COPYRIGHT: Copyright (C) 2021 Ultra Librarian. All rights reserved.; DESCRIPTION_VALUE: CAP ALUM 100UF 20% 50V SMD; DIGI-KEY_PART_NUMBER: 1189-2059-1-ND; DIGIKEY_LINK: https://www.digikey.com/en/products/detail/rubycon/50THV100M10X10-5/3568792?s=N4IgTCBcDaIIxwBwE4C0YAMBWNdUDkAREAXQF8g; FOOTPRINT_PACKAGE: Radial, Can - SMD; FUNCTION: power (10V); MF: Rubycon; MF_PART_NUMBER: 50THV100M10X10.5
C5 C6 = lib_v3:50THV100M10X10.5: Capacitor 100 µF ±20% 50V Aluminum Electrolytic Capacitor Radial, Can - SMD 250mOhm @ 100kHz 3000 Hrs @ 125°C; COPYRIGHT: Copyright (C) 2021 Ultra Librarian. All rights reserved.; DESCRIPTION_VALUE: CAP ALUM 100UF 20% 50V SMD; DIGI-KEY_PART_NUMBER: 1189-2059-1-ND; DIGIKEY_LINK: https://www.digikey.com/en/products/detail/rubycon/50THV100M10X10-5/3568792?s=N4IgTCBcDaIIxwBwE4C0YAMBWNdUDkAREAXQF8g; FOOTPRINT_PACKAGE: Radial, Can - SMD; FUNCTION: power (24V); MF: Rubycon; MF_PART_NUMBER: 50THV100M10X10.5
C7 = lib_v3:CAP_CGA3E2X7R1H104M080AD: Capacitor 0.1 µF ±20% 50V Ceramic Capacitor X7R 0603 (1608 Metric); DESCRIPTION_VALUE: CAP CER 0.1UF 50V X7R 0603 EPOXY; DIGI-KEY_PART_NUMBER: 445-9834-1-ND; DIGIKEY_LINK: https://www.digikey.com/en/products/detail/tdk-corporation/CGA3E2X7R1H104M080AD/3933567?s=N4IgTCBcDaIMIHECCBmAomAGgdgEoEYAJfABgBYBZEgDhKQBEQBdAXyA; FOOTPRINT_PACKAGE: 0603 (1608 Metric); FUNCTION: voltage regulator; MF: TDK Corporation; MF_PART_NUMBER: CGA3E2X7R1H104M080AD
C8 = lib_v3:CAP_CGA3E2X7R1H104M080AD: Capacitor 0.1 µF ±20% 50V Ceramic Capacitor X7R 0603 (1608 Metric); DESCRIPTION_VALUE: CAP CER 0.1UF 50V X7R 0603 EPOXY; DIGI-KEY_PART_NUMBER: 445-9834-1-ND; DIGIKEY_LINK: https://www.digikey.com/en/products/detail/tdk-corporation/CGA3E2X7R1H104M080AD/3933567?s=N4IgTCBcDaIMIHECCBmAomAGgdgEoEYAJfABgBYBZEgDhKQBEQBdAXyA; FOOTPRINT_PACKAGE: 0603 (1608 Metric); FUNCTION: power (24V); MF: TDK Corporation; MF_PART_NUMBER: CGA3E2X7R1H104M080AD
C9 = lib_v3:CAP_CGA3E2X7R1H103K080AE: Capacitor 10000 pF ±10% 50V Ceramic Capacitor X7R 0603 (1608 Metric); 3DPACKAGE_LINK: https://www.snapeda.com/parts/CGA3E2X7R1H103K080AE/TDK/view-part/1770912/?ref=search&t=CGA3E2X7R1H103K080AE; COPYRIGHT: Copyright (C) 2021 Ultra Librarian. All rights reserved.; DESCRIPTION_VALUE: CAP CER 10000PF 50V X7R 0603; DIGI-KEY_PART_NUMBER: 445-15955-1-ND; DIGIKEY_LINK: https://www.digikey.com/en/products/detail/tdk-corporation/CGA3E2X7R1H103K080AE/4490592?s=N4IgTCBcDaIMIHECCBmAomAGgdgEoEYAJfABhQGkSAOEpNEAXQF8g; FOOTPRINT_PACKAGE: 0603 (1608 Metric); FUNCTION: power (10V); MF: TDK; MF_PART_NUMBER: CGA3E2X7R1H103K080AE
C10 = lib_v3:CAP_CGA3E2X7R1H103K080AE: Capacitor 10000 pF ±10% 50V Ceramic Capacitor X7R 0603 (1608 Metric); 3DPACKAGE_LINK: https://www.snapeda.com/parts/CGA3E2X7R1H103K080AE/TDK/view-part/1770912/?ref=search&t=CGA3E2X7R1H103K080AE; COPYRIGHT: Copyright (C) 2021 Ultra Librarian. All rights reserved.; DESCRIPTION_VALUE: CAP CER 10000PF 50V X7R 0603; DIGI-KEY_PART_NUMBER: 445-15955-1-ND; DIGIKEY_LINK: https://www.digikey.com/en/products/detail/tdk-corporation/CGA3E2X7R1H103K080AE/4490592?s=N4IgTCBcDaIMIHECCBmAomAGgdgEoEYAJfABhQGkSAOEpNEAXQF8g; FOOTPRINT_PACKAGE: 0603 (1608 Metric); FUNCTION: power (24V); MF: TDK; MF_PART_NUMBER: CGA3E2X7R1H103K080AE
D1-D8 = lib_v3:RB168VYM150FHTR: Diode Schottky 150 V 1A Surface Mount TUMD2M; 3DPACKAGE_LINK: https://app.ultralibrarian.com/details/51EB5428-E6C6-11E9-B85E-0AD2C9526B44/ROHM-Semiconductor/RB168VYM150FHTR?ref=digikey&exports=Eagle&open=exports; COPYRIGHT: Copyright (C) 2018 Accelerated Designs. All rights reserved; DESCRIPTION_VALUE: SCHOTTKY BARRIER DIODE (AEC-Q101; DIGI-KEY_PART_NUMBER: RB168VYM150FHCT-ND; DIGIKEY_LINK: https://www.digikey.com/en/products/detail/rohm-semiconductor/RB168VYM150FHTR/8028502; FOOTPRINT_PACKAGE: 2-SMD, Flat Lead; FUNCTION: isolation valve driver; MF: ROHM Semiconductor; MF_PART_NUMBER: RB168VYM150FHTR; SOURCELIBRARY: Rohm_2019-09-23
D9 = lib_v3:RB168VYM150FHTR: Diode Schottky 150 V 1A Surface Mount TUMD2M; 3DPACKAGE_LINK: https://app.ultralibrarian.com/details/51EB5428-E6C6-11E9-B85E-0AD2C9526B44/ROHM-Semiconductor/RB168VYM150FHTR?ref=digikey&exports=Eagle&open=exports; COPYRIGHT: Copyright (C) 2018 Accelerated Designs. All rights reserved; DESCRIPTION_VALUE: SCHOTTKY BARRIER DIODE (AEC-Q101; DIGI-KEY_PART_NUMBER: RB168VYM150FHCT-ND; DIGIKEY_LINK: https://www.digikey.com/en/products/detail/rohm-semiconductor/RB168VYM150FHTR/8028502; FOOTPRINT_PACKAGE: 2-SMD, Flat Lead; FUNCTION: extra iso valve #1; MF: ROHM Semiconductor; MF_PART_NUMBER: RB168VYM150FHTR; SOURCELIBRARY: Rohm_2019-09-23
D10 = lib_v3:RB168VYM150FHTR: Diode Schottky 150 V 1A Surface Mount TUMD2M; 3DPACKAGE_LINK: https://app.ultralibrarian.com/details/51EB5428-E6C6-11E9-B85E-0AD2C9526B44/ROHM-Semiconductor/RB168VYM150FHTR?ref=digikey&exports=Eagle&open=exports; COPYRIGHT: Copyright (C) 2018 Accelerated Designs. All rights reserved; DESCRIPTION_VALUE: SCHOTTKY BARRIER DIODE (AEC-Q101; DIGI-KEY_PART_NUMBER: RB168VYM150FHCT-ND; DIGIKEY_LINK: https://www.digikey.com/en/products/detail/rohm-semiconductor/RB168VYM150FHTR/8028502; FOOTPRINT_PACKAGE: 2-SMD, Flat Lead; FUNCTION: extra iso valve #2; MF: ROHM Semiconductor; MF_PART_NUMBER: RB168VYM150FHTR; SOURCELIBRARY: Rohm_2019-09-23
FL1-FL9 = lib_v3:CONN_03_FL: 3 Position Header Connector 0.100" (2.54mm) Through Hole Gold; 3DPACKAGE_LINK: https://componentsearchengine.com/part-view/PPPC031LFBN-RC/Sullins; 3DPACKAGE_SOURCE: Component Search Engine; DESCRIPTION_VALUE: CONN HDR 3POS 0.1 GOLD PCB; DIGI-KEY_PART_NUMBER: S7036-ND; DIGIKEY_LINK: https://www.digikey.com/en/products/detail/sullins-connector-solutions/PPPC031LFBN-RC/810175; FUNCTION: connector to flow sensor; MF: Sullins Connector Solutions; MF_PART_NUMBER: PPPC031LFBN-RC
HS1 HS2 = lib_v3:V8813W: Heat Sink SOT-32, TO-220, TOP-3 Aluminum Board Level, Vertical; 3DPACKAGE_SOURCE: me; DESCRIPTION_VALUE: HEATSINK TO-220/TOP-3/SOT-32; DIGI-KEY_PART_NUMBER: AE10771-ND; DIGIKEY_LINK: https://www.digikey.com/en/products/detail/assmann-wsw-components/V8813W/3511502; MF: Assmann WSW Components; MF_PART_NUMBER: V8813W
IC1 = lib_v3:TS321AILT: General Purpose Amplifier 1 Circuit SOT-23-5; 3DPACKAGE_SOURCE: Ultra Librarian; COPYRIGHT: Copyright (C) 2022 Ultra Librarian. All rights reserved.; DESCRIPTION_VALUE: IC OPAMP GP 1 CIRCUIT SOT23-5; DIGI-KEY_PART_NUMBER: 497-8093-1-ND; DIGIKEY_LINK: https://www.digikey.com/en/products/detail/stmicroelectronics/TS321AILT/1040162; MF: STMicroelectronics; MF_PART_NUMBER: TS321AILT
J1 = lib_v3:PJ-037AH: DC Power Jack Connector 2.0 x 6.5 mm, 5.0 A Through Hole, Right Angle from CUI Devices website https://www.cuidevices.com/product/resource/digikeypcbfootprint/pj-037ah from Digi-Key: Power Barrel Connector Jack 2.10mm ID (0.083"), 5.50mm OD (0.217") Through Hole, Right Angle; 3DPACKAGE_SOURCE: https://www.cuidevices.com/product/resource/digikey3dmodel/pj-037ah; DESCRIPTION_VALUE: CONN PWR JACK 2X5.5MM SOLDER; DIGI-KEY_PART_NUMBER: CP-037AH-ND; DIGIKEY_LINK: https://www.digikey.com/en/products/detail/cui-devices/PJ-037AH/1644547; FOOTPRINT_SOURCE: https://www.cuidevices.com/product/resource/pcbfootprint/pj-037ah; FUNCTION: power jack for +24V supply; MF: CUI Devices; MF_PART_NUMBER: PJ-037AH
J2 = lib_v3:MOLEX_436500415: Connector Header Through Hole 4 position 0.118" (3.00mm); 3DPACKAGE_LINK: https://www.molex.com/molex/products/part-detail/pcb_headers/0436500415; DESCRIPTION_VALUE: CONN HEADER VERT 4POS 3MM; DIGI-KEY_PART_NUMBER: WM1919-ND; DIGIKEY_LINK: https://www.digikey.com/en/products/detail/molex/0436500415/283463?s=N4IgTCBcDaIOoFkCMBOVBaAcgERAXQF8g; FUNCTION: master I2C pins; MF: Molex; MF_PART_NUMBER: 0436500415
J3 J4 = lib_v3:MOLEX_436500215: Connector Header Through Hole 2 position 0.118" (3.00mm); 3DPACKAGE_LINK: https://www.molex.com/molex/products/part-detail/pcb_headers/0436500215; DESCRIPTION_VALUE: CONN HEADER VERT 2POS 3MM; DIGI-KEY_PART_NUMBER: WM1917-ND; DIGIKEY_LINK: https://www.digikey.com/en/products/detail/molex/0436500215/283461?s=N4IgTCBcDaIOoFkCMBOJB2AtAOQCIgF0BfIA; MF: Molex; MF_PART_NUMBER: 0436500215
JP1 = lib_v3:CONN_10P_TE_1761681-3: Connector Header Through Hole 10 position 0.100" (2.54mm); 3DPACKAGE_LINK: https://www.te.com/usa-en/product-1761681-3.html; DESCRIPTION_VALUE: CONN HEADER VERT 10POS 2.54MM; DIGI-KEY_PART_NUMBER: 1761681-3-ND; DIGIKEY_LINK: https://www.digikey.com/en/products/detail/te-connectivity-amp-connectors/1761681-3/2055463; FUNCTION: connector to isolation valves; MF: TE Connectivity AMP Connectors; MF_PART_NUMBER: 1761681-3; NOTE: unclear if this is the correct item
JP2-JP4 = lib_v3:CONN_06_HEADER: Connector Header Through Hole 6 position 0.100" (2.54mm); 3DPACKAGE_LINK: https://www.te.com/usa-en/product-1761681-1.html?te_bu=Cor&te_type=other&te_campaign=ult_glo_3d-cad&elqCampaignId=26141#pdp-docs-features; DESCRIPTION_VALUE: CONN HEADER VERT 6POS 2.54MM; DIGI-KEY_PART_NUMBER: A122759-ND; DIGIKEY_LINK: https://www.digikey.com/en/products/detail/te-connectivity-amp-connectors/1761681-1/2285111; FOOTPRINT_SOURCE: SnapEDA; MF: TE Connectivity AMP Connectors; MF_PART_NUMBER: 1761681-1
LED1 LED2 = lib_v3:LED_VLMG_1300: LED Indication Green 571nm Discrete 2V 0603 (1608 Metric); DESCRIPTION_VALUE: LED GREEN 0603 SMD; DIGI-KEY_PART_NUMBER: VLMG1300-GS08CT-ND; DIGIKEY_LINK: https://www.digikey.com/en/products/detail/vishay-semiconductor-opto-division/VLMG1300-GS08/2813350; FOOTPRINT_PACKAGE: 0603 (1608 Metric); FUNCTION: power indicator; MF: Vishay Semiconductor Opto Division; MF_PART_NUMBER: VLMG1300-GS08
LED_V1-LED_V8 = lib_v3:LED_VLMB_1300: LED Indication Blue 470nm Discrete 3.3V 0603 (1608 Metric); DESCRIPTION_VALUE: LED BLUE 0603 SMD; DIGI-KEY_PART_NUMBER: VLMB1300-GS08CT-ND; DIGIKEY_LINK: https://www.digikey.com/en/products/detail/vishay-semiconductor-opto-division/VLMB1300-GS08/3025494; FOOTPRINT_PACKAGE: 0603 (1608 Metric); FUNCTION: isolation valve indicator; MF: Vishay Semiconductor Opto Division; MF_PART_NUMBER: VLMB1300-GS08
LED_V9 = lib_v3:LED_VLMB_1300: LED Indication Blue 470nm Discrete 3.3V 0603 (1608 Metric); DESCRIPTION_VALUE: LED BLUE 0603 SMD; DIGI-KEY_PART_NUMBER: VLMB1300-GS08CT-ND; DIGIKEY_LINK: https://www.digikey.com/en/products/detail/vishay-semiconductor-opto-division/VLMB1300-GS08/3025494; FOOTPRINT_PACKAGE: 0603 (1608 Metric); FUNCTION: extra iso valve #1; MF: Vishay Semiconductor Opto Division; MF_PART_NUMBER: VLMB1300-GS08
LED_V10 = lib_v3:LED_VLMB_1300: LED Indication Blue 470nm Discrete 3.3V 0603 (1608 Metric); DESCRIPTION_VALUE: LED BLUE 0603 SMD; DIGI-KEY_PART_NUMBER: VLMB1300-GS08CT-ND; DIGIKEY_LINK: https://www.digikey.com/en/products/detail/vishay-semiconductor-opto-division/VLMB1300-GS08/3025494; FOOTPRINT_PACKAGE: 0603 (1608 Metric); FUNCTION: extra iso valve #2; MF: Vishay Semiconductor Opto Division; MF_PART_NUMBER: VLMB1300-GS08
PV1 = lib_v3:MOLEX_436500215: Connector Header Through Hole 2 position 0.118" (3.00mm)
PV2-PV9 = lib_v3:MOLEX_436500215: Connector Header Through Hole 2 position 0.118" (3.00mm); FUNCTION: connector to proportional valves
R1 R2 = lib_v3:RES_4816P-1-103LF: Resistor 10k Ohm ±2% 160mW Power Per Element Isolated 8 Resistor Network/Array ±100ppm/°C 16-SOIC (0.220", 5.59mm Width); 3DPACKAGE_LINK: https://www.snapeda.com/parts/4816P-1-102LF/Bourns/view-part/382435/?ref=search&t=4816P-1-102LF; DESCRIPTION_VALUE: RES ARRAY 8 RES 10K OHM 16SOIC; DIGI-KEY_PART_NUMBER: 4816P-1-103LFCT-ND; DIGIKEY_LINK: https://www.digikey.com/en/products/detail/bourns-inc/4816P-1-103LF/1958036?s=N4IgTCBcDaICwA4CMA2ACgWiVgDAZgBkAxEAXQF8g; FOOTPRINT_PACKAGE: 16-SOIC (0.220", 5.59mm Width); FUNCTION: isolation valve driver; MF: Bourns Electronics; MF_PART_NUMBER: 4816P-1-103LF; SOURCELIBRARY: Bourns_2014-12-31
R3 = lib_v3:RES_4816P-1-102LF: Resistor 1k Ohm ±2% 160mW Power Per Element Isolated 8 Resistor Network/Array ±100ppm/°C 16-SOIC (0.220", 5.59mm Width); 3DPACKAGE_LINK: https://www.snapeda.com/parts/4816P-1-102LF/Bourns/view-part/382435/?ref=search&t=4816P-1-102LF; DESCRIPTION_VALUE: RES ARRAY 8 RES 1K OHM 16SOIC; DIGI-KEY_PART_NUMBER: 4816P-1-102LFCT-ND; DIGIKEY_LINK: https://www.digikey.com/en/products/detail/bourns-inc/4816P-1-102LF/1958035?s=N4IgTCBcDaICwA4CMA2ACgWiVgDGAMgGIgC6AvkA; FOOTPRINT_PACKAGE: 16-SOIC (0.220", 5.59mm Width); FUNCTION: isolation valve driver; MF: Bourns Electronics; MF_PART_NUMBER: 4816P-1-102LF; SOURCELIBRARY: Bourns_2014-12-31
R4 R9 R20 R22 R24 R29 R40 R42 R65 = lib_v3:CRCW12062R20FKEA: Resistor 2.2 Ohms ±1% 0.25W 1/4W Chip Resistor 1206 (3216 Metric) Automotive AEC-Q200 Thick Film; 3DPACKAGE_SOURCE: made from datasheet; DESCRIPTION_VALUE: RES SMD 2.2 OHM 1% 1/4W 1206; DIGI-KEY_PART_NUMBER: 541-2.20FFCT-ND; DIGIKEY_LINK: https://www.digikey.com/en/products/detail/vishay-dale/CRCW12062R20FKEA/1961801?s=N4IgTCBcDaIKwBYCMBaMA6MAGAYjgwgCooByAIiALoC%2BQA; FOOTPRINT_PACKAGE: 1206 (3216 Metric); FUNCTION: prop valve driver; MF: Vishay Dale; MF_PART_NUMBER: CRCW12062R20FKEA; PACKAGE: 3116 Vishay
R5 R10 R21 R23 R25 R30 R41 R43 R66 = lib_v3:ERJPA3F1001V: Resistor 1 kOhms ±1% 0.333W 1/3W Chip Resistor 0603 (1608 Metric) Automotive AEC-Q200, Pulse Withstanding Thick Film; 3DPACKAGE_LINK: https://www.snapeda.com/parts/CRCW12062R20FKEA/Vishay%20Dale/view-part/6768481/?ref=search&t=CRCW12062R20FKEA; DESCRIPTION_VALUE: RES SMD 1K OHM 1% 1/4W 0603; DIGI-KEY_PART_NUMBER: P1.0KBYCT-ND; DIGIKEY_LINK: https://www.digikey.com/en/products/detail/panasonic-electronic-components/ERJ-PA3F1001V/5035848?s=N4IgTCBcDaIAoEYB0AGA0gIQJoGEAqAtAHIAiIAugL5A; FOOTPRINT_PACKAGE: 0603 (1608 Metric); FUNCTION: prop valve driver; MF: Panasonic; MF_PART_NUMBER: ERJPA3F1001V; PACKAGE: 1608-2 Panasonic
R6 R11 R14 R17 R26 R31 R34 R37 R62 = lib_v3:SR0603FR-7T100KL: Resistor 100 kOhms ±1% 0.25W 1/4W Chip Resistor 0603 (1608 Metric) Automotive AEC-Q200, Pulse Withstanding Thick Film; 3DPACKAGE_LINK: https://www.snapeda.com/parts/SR0603FR-7T100KL/Yageo/view-part/3876194/?ref=search&t=SR0603FR-7T100KL; DESCRIPTION_VALUE: RES 100K OHM 1% 1/4W 0603; DIGI-KEY_PART_NUMBER: YAG5821CT-ND; DIGIKEY_LINK: https://www.digikey.com/en/products/detail/yageo/SR0603FR-7T100KL/9373095?s=N4IgTCBcDaIMoCUAMA2JBmAYggtAdgBUBGJJAaQBkQBdAXyA; FOOTPRINT_PACKAGE: 0603 (1608 Metric); FUNCTION: prop valve driver; MF: Yageo; MF_PART_NUMBER: SR0603FR-7T100KL; PACKAGE: 1608 Yageo
R7 R12 R15 R18 R27 R32 R35 R38 R63 = lib_v3:SR0603FR-7T2K2L: Resistor 2.2 kOhms ±1% 0.25W 1/4W Chip Resistor 0603 (1608 Metric) Automotive AEC-Q200, Pulse Withstanding Thick Film; 3DPACKAGE_LINK: https://www.snapeda.com/parts/SR0603FR-7T2K2L/Yageo/view-part/3874250/?ref=search&t=SR0603FR-7T2K2L; DESCRIPTION_VALUE: RES 2.2K OHM 1% 1/4W 0603; DIGI-KEY_PART_NUMBER: YAG5834CT-ND; DIGIKEY_LINK: https://www.digikey.com/en/products/detail/yageo/SR0603FR-7T2K2L/9373108?s=N4IgTCBcDaIMoCUAMA2JBmAYggtAdgBUwBpMAGRAF0BfIA; FOOTPRINT_PACKAGE: 0603 (1608 Metric); FUNCTION: prop valve driver; MF: Yageo; MF_PART_NUMBER: SR0603FR-7T2K2L; PACKAGE: 1608 Yageo
R8 R13 R16 R19 R28 R33 R36 R39 R64 = lib_v3:RCS0603120RFKEA: Resistor 120 Ohms ±1% 0.25W 1/4W Chip Resistor 0603 (1608 Metric) Automotive AEC-Q200, Pulse Withstanding Thick Film; 3DPACKAGE_LINK: https://www.snapeda.com/parts/RCS0603120RFKEA/Vishay/view-part/947981/?ref=search&t=RCS0603120RFKEA; 3DPACKAGE_SOURCE: made from datasheet; DESCRIPTION_VALUE: RES SMD 120 OHM 1% 1/4W 0603; DIGI-KEY_PART_NUMBER: 541-10426-1-ND; DIGIKEY_LINK: https://www.digikey.com/en/products/detail/vishay-dale/RCS0603120RFKEA/5868381?s=N4IgTCBcDaIKwBYCMBaJAGBYBsaUDkAREAXQF8g; FOOTPRINT_PACKAGE: 0603 (1608 Metric); FUNCTION: prop valve driver; MF: Vishay; MF_PART_NUMBER: RCS0603120RFKEA; PACKAGE: 1508 Vishay
R44-R51 = lib_v3:RCS0603120RFKEA: Resistor 120 Ohms ±1% 0.25W 1/4W Chip Resistor 0603 (1608 Metric) Automotive AEC-Q200, Pulse Withstanding Thick Film; 3DPACKAGE_LINK: https://www.snapeda.com/parts/RCS0603120RFKEA/Vishay/view-part/947981/?ref=search&t=RCS0603120RFKEA; 3DPACKAGE_SOURCE: made from datasheet; DESCRIPTION_VALUE: RES SMD 120 OHM 1% 1/4W 0603; DIGI-KEY_PART_NUMBER: 541-10426-1-ND; DIGIKEY_LINK: https://www.digikey.com/en/products/detail/vishay-dale/RCS0603120RFKEA/5868381?s=N4IgTCBcDaIKwBYCMBaJAGBYBsaUDkAREAXQF8g; FOOTPRINT_PACKAGE: 0603 (1608 Metric); FUNCTION: iso valve LEDs; MF: Vishay; MF_PART_NUMBER: RCS0603120RFKEA; PACKAGE: 1508 Vishay
R52 = lib_v3:RCS06031K20FKEA: Resistor 1.2 kOhms ±1% 0.25W 1/4W Chip Resistor 0603 (1608 Metric) Automotive AEC-Q200, Pulse Withstanding Thick Film; DESCRIPTION_VALUE: RES SMD 1.2K OHM 1% 1/4W 0603; DIGI-KEY_PART_NUMBER: 541-10435-1-ND; DIGIKEY_LINK: https://www.digikey.com/en/products/detail/vishay-dale/RCS06031K20FKEA/5868493; FOOTPRINT_PACKAGE: 0603 (1608 Metric); FUNCTION: +24V power LED; MF: Vishay; MF_PART_NUMBER: RCS06031K20FKEA
R53 = lib_v3:RCS0603470RFKEA: Resistor 470 Ohms ±1% 0.25W 1/4W Chip Resistor 0603 (1608 Metric) Automotive AEC-Q200, Pulse Withstanding Thick Film; 3DPACKAGE_SOURCE: made from datasheet; DESCRIPTION_VALUE: RES SMD 470 OHM 1% 1/4W 0603; DIGI-KEY_PART_NUMBER: 541-10469-1-ND; DIGIKEY_LINK: https://www.digikey.com/en/products/detail/vishay-dale/RCS0603470RFKEA/5868449; FOOTPRINT_PACKAGE: 0603 (1608 Metric); FUNCTION: +10V power LED; MF: Vishay Dale; MF_PART_NUMBER: RCS0603470RFKEA
R54 = lib_v3:ERJPA3F1001V: Resistor 1 kOhms ±1% 0.333W 1/3W Chip Resistor 0603 (1608 Metric) Automotive AEC-Q200, Pulse Withstanding Thick Film; 3DPACKAGE_LINK: https://www.snapeda.com/parts/CRCW12062R20FKEA/Vishay%20Dale/view-part/6768481/?ref=search&t=CRCW12062R20FKEA; DESCRIPTION_VALUE: RES SMD 1K OHM 1% 1/4W 0603; DIGI-KEY_PART_NUMBER: P1.0KBYCT-ND; DIGIKEY_LINK: https://www.digikey.com/en/products/detail/panasonic-electronic-components/ERJ-PA3F1001V/5035848?s=N4IgTCBcDaIAoEYB0AGA0gIQJoGEAqAtAHIAiIAugL5A; FOOTPRINT_PACKAGE: 0603 (1608 Metric); FUNCTION: extra iso valve #1; MF: Panasonic; MF_PART_NUMBER: ERJPA3F1001V; PACKAGE: 1608-2 Panasonic
R55 R56 = lib_v3:ERJ-PA3F1002V: Resistor 10 kOhms ±1% 0.333W 1/3W Chip Resistor 0603 (1608 Metric) Automotive AEC-Q200, Pulse Withstanding Thick Film; DESCRIPTION_VALUE: RES SMD 10K OHM 1% 1/3W 0603; DIGI-KEY_PART_NUMBER: P10KBYCT-ND; DIGIKEY_LINK: https://www.digikey.com/en/products/detail/panasonic-electronic-components/ERJ-PA3F1002V/5035849; FOOTPRINT_PACKAGE: 0603 (1608 Metric); FUNCTION: extra iso valve #1; MF: Panasonic; MF_PART_NUMBER: ERJ-PA3F1002V
R57 = lib_v3:ERJPA3F1001V: Resistor 1 kOhms ±1% 0.333W 1/3W Chip Resistor 0603 (1608 Metric) Automotive AEC-Q200, Pulse Withstanding Thick Film; 3DPACKAGE_LINK: https://www.snapeda.com/parts/CRCW12062R20FKEA/Vishay%20Dale/view-part/6768481/?ref=search&t=CRCW12062R20FKEA; DESCRIPTION_VALUE: RES SMD 1K OHM 1% 1/4W 0603; DIGI-KEY_PART_NUMBER: P1.0KBYCT-ND; DIGIKEY_LINK: https://www.digikey.com/en/products/detail/panasonic-electronic-components/ERJ-PA3F1001V/5035848?s=N4IgTCBcDaIAoEYB0AGA0gIQJoGEAqAtAHIAiIAugL5A; FOOTPRINT_PACKAGE: 0603 (1608 Metric); FUNCTION: extra iso valve #2; MF: Panasonic; MF_PART_NUMBER: ERJPA3F1001V; PACKAGE: 1608-2 Panasonic
R58 R59 = lib_v3:ERJ-PA3F1002V: Resistor 10 kOhms ±1% 0.333W 1/3W Chip Resistor 0603 (1608 Metric) Automotive AEC-Q200, Pulse Withstanding Thick Film; DESCRIPTION_VALUE: RES SMD 10K OHM 1% 1/3W 0603; DIGI-KEY_PART_NUMBER: P10KBYCT-ND; DIGIKEY_LINK: https://www.digikey.com/en/products/detail/panasonic-electronic-components/ERJ-PA3F1002V/5035849; FOOTPRINT_PACKAGE: 0603 (1608 Metric); FUNCTION: extra iso valve #2; MF: Panasonic; MF_PART_NUMBER: ERJ-PA3F1002V
R60 = lib_v3:RCS0603120RFKEA: Resistor 120 Ohms ±1% 0.25W 1/4W Chip Resistor 0603 (1608 Metric) Automotive AEC-Q200, Pulse Withstanding Thick Film; 3DPACKAGE_LINK: https://www.snapeda.com/parts/RCS0603120RFKEA/Vishay/view-part/947981/?ref=search&t=RCS0603120RFKEA; 3DPACKAGE_SOURCE: made from datasheet; DESCRIPTION_VALUE: RES SMD 120 OHM 1% 1/4W 0603; DIGI-KEY_PART_NUMBER: 541-10426-1-ND; DIGIKEY_LINK: https://www.digikey.com/en/products/detail/vishay-dale/RCS0603120RFKEA/5868381?s=N4IgTCBcDaIKwBYCMBaJAGBYBsaUDkAREAXQF8g; FOOTPRINT_PACKAGE: 0603 (1608 Metric); FUNCTION: extra iso valve #1; MF: Vishay; MF_PART_NUMBER: RCS0603120RFKEA; PACKAGE: 1508 Vishay
R61 = lib_v3:RCS0603120RFKEA: Resistor 120 Ohms ±1% 0.25W 1/4W Chip Resistor 0603 (1608 Metric) Automotive AEC-Q200, Pulse Withstanding Thick Film; 3DPACKAGE_LINK: https://www.snapeda.com/parts/RCS0603120RFKEA/Vishay/view-part/947981/?ref=search&t=RCS0603120RFKEA; 3DPACKAGE_SOURCE: made from datasheet; DESCRIPTION_VALUE: RES SMD 120 OHM 1% 1/4W 0603; DIGI-KEY_PART_NUMBER: 541-10426-1-ND; DIGIKEY_LINK: https://www.digikey.com/en/products/detail/vishay-dale/RCS0603120RFKEA/5868381?s=N4IgTCBcDaIKwBYCMBaJAGBYBsaUDkAREAXQF8g; FOOTPRINT_PACKAGE: 0603 (1608 Metric); FUNCTION: extra iso valve #2; MF: Vishay; MF_PART_NUMBER: RCS0603120RFKEA; PACKAGE: 1508 Vishay
S1 = lib_v3:1-1825059-7: SPST Flush Slide Sealed 2.54 mm Pitch Surface Mount DIP Switch; 3DPACKAGE_LINK: https://www.te.com/usa-en/product-1-1825059-7.html; DESCRIPTION_VALUE: SWITCH SLIDE DIP SPST 25MA 24V; DIGI-KEY_PART_NUMBER: 1-1825059-7-ND; DIGIKEY_LINK: https://www.digikey.com/en/products/detail/te-connectivity-alcoswitch-switches/1-1825059-7/1202121?s=N4IgTCBcDaIIwFo4A4wFYAMaCcCDsCAcgCIgC6AvkA; FUNCTION: I2C address select; MF: TE Connectivity; MF_PART_NUMBER: 1-1825059-7; PACKAGE: SMD-6 Omron Electronics
U1-U8 = lib_v3:ZXMP7A17: MOSFET P-Channel 70 V 2.6A (Ta) 2W (Ta) Surface Mount SOT-223-3; 3DPACKAGE_LINK: https://app.ultralibrarian.com/details/2CBFA7CB-10A1-11E9-AB3A-0A3560A4CCCC/Diodes-Inc/ZXMP7A17GQTA?ref=digikey&open=exports&exports=ThreeDModel; 3DPACKAGE_SOURCE: Ultra Librarian; DESCRIPTION_VALUE: MOSFET P-CH 70V 2.6A SOT223; DIGI-KEY_PART_NUMBER: ZXMP7A17GQTADICT-ND; DIGIKEY_LINK: https://www.digikey.com/en/products/detail/diodes-incorporated/ZXMP7A17GQTA/4747698; FOOTPRINT_PACKAGE: SOT223; FUNCTION: isolation valve driver; MF: Diodes Incorporated; MF_PART_NUMBER: ZXMP7A17GQTA; NOTE: unclear if this is the one John meant
U9-U16 = lib_v3:IRLML6244TR: MOSFET N-Channel N-Channel 20 V 6.3A (Ta) 1.3W (Ta) Surface Mount Micro3™/SOT-23 confirmed footprint & pin mapping 11/2/2022; 3DPACKAGE_LINK: https://app.ultralibrarian.com/details/A1C9E1FE-7D1F-11EA-8C00-0AD2C9526B44/Infineon/IRLML6244TRPBF?ref=digikey&open=exports&exports=ThreeDModel; 3DPACKAGE_SOURCE: Ultra Librarian; DESCRIPTION_VALUE: MOSFET N-CH 20V 6.3A SOT23; DIGI-KEY_PART_NUMBER: IRLML6244TRPBFCT-ND; DIGIKEY_LINK: https://www.digikey.com/en/products/detail/infineon-technologies/IRLML6244TRPBF/2393871?s=N4IgTCBcDaIJICUAyBZJA2MAWLAVBIAugL5A; FOOTPRINT_PACKAGE: Micro3 (SOT-23); FOOTPRINT_SOURCE: confirmed footprint & pin mapping 11/2/2022; FUNCTION: isolation valve driver; MF: Infineon Technologies; MF_PART_NUMBER: IRLML6244TRPBF
U17-U20 U22-U25 U31 = lib_v3:IRLML6244TR: MOSFET N-Channel N-Channel 20 V 6.3A (Ta) 1.3W (Ta) Surface Mount Micro3™/SOT-23 confirmed footprint & pin mapping 11/2/2022; 3DPACKAGE_LINK: https://app.ultralibrarian.com/details/A1C9E1FE-7D1F-11EA-8C00-0AD2C9526B44/Infineon/IRLML6244TRPBF?ref=digikey&open=exports&exports=ThreeDModel; 3DPACKAGE_SOURCE: Ultra Librarian; DESCRIPTION_VALUE: MOSFET N-CH 20V 6.3A SOT23; DIGI-KEY_PART_NUMBER: IRLML6244TRPBFCT-ND; DIGIKEY_LINK: https://www.digikey.com/en/products/detail/infineon-technologies/IRLML6244TRPBF/2393871?s=N4IgTCBcDaIJICUAyBZJA2MAWLAVBIAugL5A; FOOTPRINT_PACKAGE: Micro3 (SOT-23); FOOTPRINT_SOURCE: confirmed footprint & pin mapping 11/2/2022; FUNCTION: prop valve driver; MF: Infineon Technologies; MF_PART_NUMBER: IRLML6244TRPBF
U21 U26 = lib_v3:LM324KAPWR: General Purpose Amplifier 4 Circuit 14-TSSOP Quadruple improved offset and ESD protection operational amplifier 14-TSSOP 0 to 70; 3DPACKAGE_LINK: https://www.snapeda.com/parts/LM324KAPWR/Texas%20Instruments/view-part/?ref=texas_in&t=LM324KAPWR&con_ref=None; DESCRIPTION_VALUE: IC OPAMP GP 4 CIRCUIT 14TSSOP; DIGI-KEY_PART_NUMBER: 296-18449-1-ND; DIGIKEY_LINK: https://www.digikey.com/en/products/detail/texas-instruments/LM324KAPWR/809732?s=N4IgTCBcDa4JwDYC0BGAHAFg3VSByAIiALoC%2BQA; FOOTPRINT_PACKAGE: 14-TSSOP (0.173", 4.40mm Width); FUNCTION: prop valve driver; MF: Texas Instruments; MF_PART_NUMBER: LM324KAPWR; PACKAGE: TSSOP-14 Texas Instruments
U27 = lib_v3:IRLML6244TR: MOSFET N-Channel N-Channel 20 V 6.3A (Ta) 1.3W (Ta) Surface Mount Micro3™/SOT-23 confirmed footprint & pin mapping 11/2/2022; 3DPACKAGE_LINK: https://app.ultralibrarian.com/details/A1C9E1FE-7D1F-11EA-8C00-0AD2C9526B44/Infineon/IRLML6244TRPBF?ref=digikey&open=exports&exports=ThreeDModel; 3DPACKAGE_SOURCE: Ultra Librarian; DESCRIPTION_VALUE: MOSFET N-CH 20V 6.3A SOT23; DIGI-KEY_PART_NUMBER: IRLML6244TRPBFCT-ND; DIGIKEY_LINK: https://www.digikey.com/en/products/detail/infineon-technologies/IRLML6244TRPBF/2393871?s=N4IgTCBcDaIJICUAyBZJA2MAWLAVBIAugL5A; FOOTPRINT_PACKAGE: Micro3 (SOT-23); FOOTPRINT_SOURCE: confirmed footprint & pin mapping 11/2/2022; FUNCTION: extra iso valve #1; MF: Infineon Technologies; MF_PART_NUMBER: IRLML6244TRPBF
U28 = lib_v3:ZXMP7A17: MOSFET P-Channel 70 V 2.6A (Ta) 2W (Ta) Surface Mount SOT-223-3; 3DPACKAGE_LINK: https://app.ultralibrarian.com/details/2CBFA7CB-10A1-11E9-AB3A-0A3560A4CCCC/Diodes-Inc/ZXMP7A17GQTA?ref=digikey&open=exports&exports=ThreeDModel; 3DPACKAGE_SOURCE: Ultra Librarian; DESCRIPTION_VALUE: MOSFET P-CH 70V 2.6A SOT223; DIGI-KEY_PART_NUMBER: ZXMP7A17GQTADICT-ND; DIGIKEY_LINK: https://www.digikey.com/en/products/detail/diodes-incorporated/ZXMP7A17GQTA/4747698; FOOTPRINT_PACKAGE: SOT223; FUNCTION: extra iso valve #1; MF: Diodes Incorporated; MF_PART_NUMBER: ZXMP7A17GQTA
U29 = lib_v3:IRLML6244TR: MOSFET N-Channel N-Channel 20 V 6.3A (Ta) 1.3W (Ta) Surface Mount Micro3™/SOT-23 confirmed footprint & pin mapping 11/2/2022; 3DPACKAGE_LINK: https://app.ultralibrarian.com/details/A1C9E1FE-7D1F-11EA-8C00-0AD2C9526B44/Infineon/IRLML6244TRPBF?ref=digikey&open=exports&exports=ThreeDModel; 3DPACKAGE_SOURCE: Ultra Librarian; DESCRIPTION_VALUE: MOSFET N-CH 20V 6.3A SOT23; DIGI-KEY_PART_NUMBER: IRLML6244TRPBFCT-ND; DIGIKEY_LINK: https://www.digikey.com/en/products/detail/infineon-technologies/IRLML6244TRPBF/2393871?s=N4IgTCBcDaIJICUAyBZJA2MAWLAVBIAugL5A; FOOTPRINT_PACKAGE: Micro3 (SOT-23); FOOTPRINT_SOURCE: confirmed footprint & pin mapping 11/2/2022; FUNCTION: extra iso valve #2; MF: Infineon Technologies; MF_PART_NUMBER: IRLML6244TRPBF
U30 = lib_v3:ZXMP7A17: MOSFET P-Channel 70 V 2.6A (Ta) 2W (Ta) Surface Mount SOT-223-3; 3DPACKAGE_LINK: https://app.ultralibrarian.com/details/2CBFA7CB-10A1-11E9-AB3A-0A3560A4CCCC/Diodes-Inc/ZXMP7A17GQTA?ref=digikey&open=exports&exports=ThreeDModel; 3DPACKAGE_SOURCE: Ultra Librarian; DESCRIPTION_VALUE: MOSFET P-CH 70V 2.6A SOT223; DIGI-KEY_PART_NUMBER: ZXMP7A17GQTADICT-ND; DIGIKEY_LINK: https://www.digikey.com/en/products/detail/diodes-incorporated/ZXMP7A17GQTA/4747698; FOOTPRINT_PACKAGE: SOT223; FUNCTION: extra iso valve #2; MF: Diodes Incorporated; MF_PART_NUMBER: ZXMP7A17GQTA
VR1 VR2 = lib_v3:L78S10CV: Linear Voltage Regulator IC Positive Fixed 1 Output 2A TO-220; DESCRIPTION_VALUE: IC REG LINEAR 10V 2A TO220AB; DIGI-KEY_PART_NUMBER: 497-6039-5-ND; DIGIKEY_LINK: https://www.digikey.com/en/products/detail/stmicroelectronics/L78S10CV/1165899; FUNCTION: voltage regulator; MF: STMicroelectronics; MF_PART_NUMBER: L78S10CV
X1 = lib_v3:ARDUINO_MEGA2560; FUNCTION: Arduino

## Net classes
0 default: width 0.203 mm, drill 0.406 mm, clearance 0.203 mm
1 power: width 0.61 mm, drill 0.406 mm, clearance 0.203 mm
2 gnd: width 0.305 mm, drill 0.406 mm, clearance 0.203 mm
3 power usb: width 0.508 mm, drill 0.406 mm, clearance 0.203 mm